# EasyEDA Pro project ProPrj_TD4-CPU_.epro, schematic TD4-CPU v1.1

## Sheets
1 ROM: Board Name: TD4_CPU v1.0; Create Date: 2024-11-04; Page Name: ROM; Project Name: CPU; Schematic Name: TD4-CPU v1.0; Update Date: 2024-11-12; Company: 嘉立创EDA; Drawed: WBH; Page Size: A3; Part Number: 20241104; Reviewed: WBH; Version: V1.0
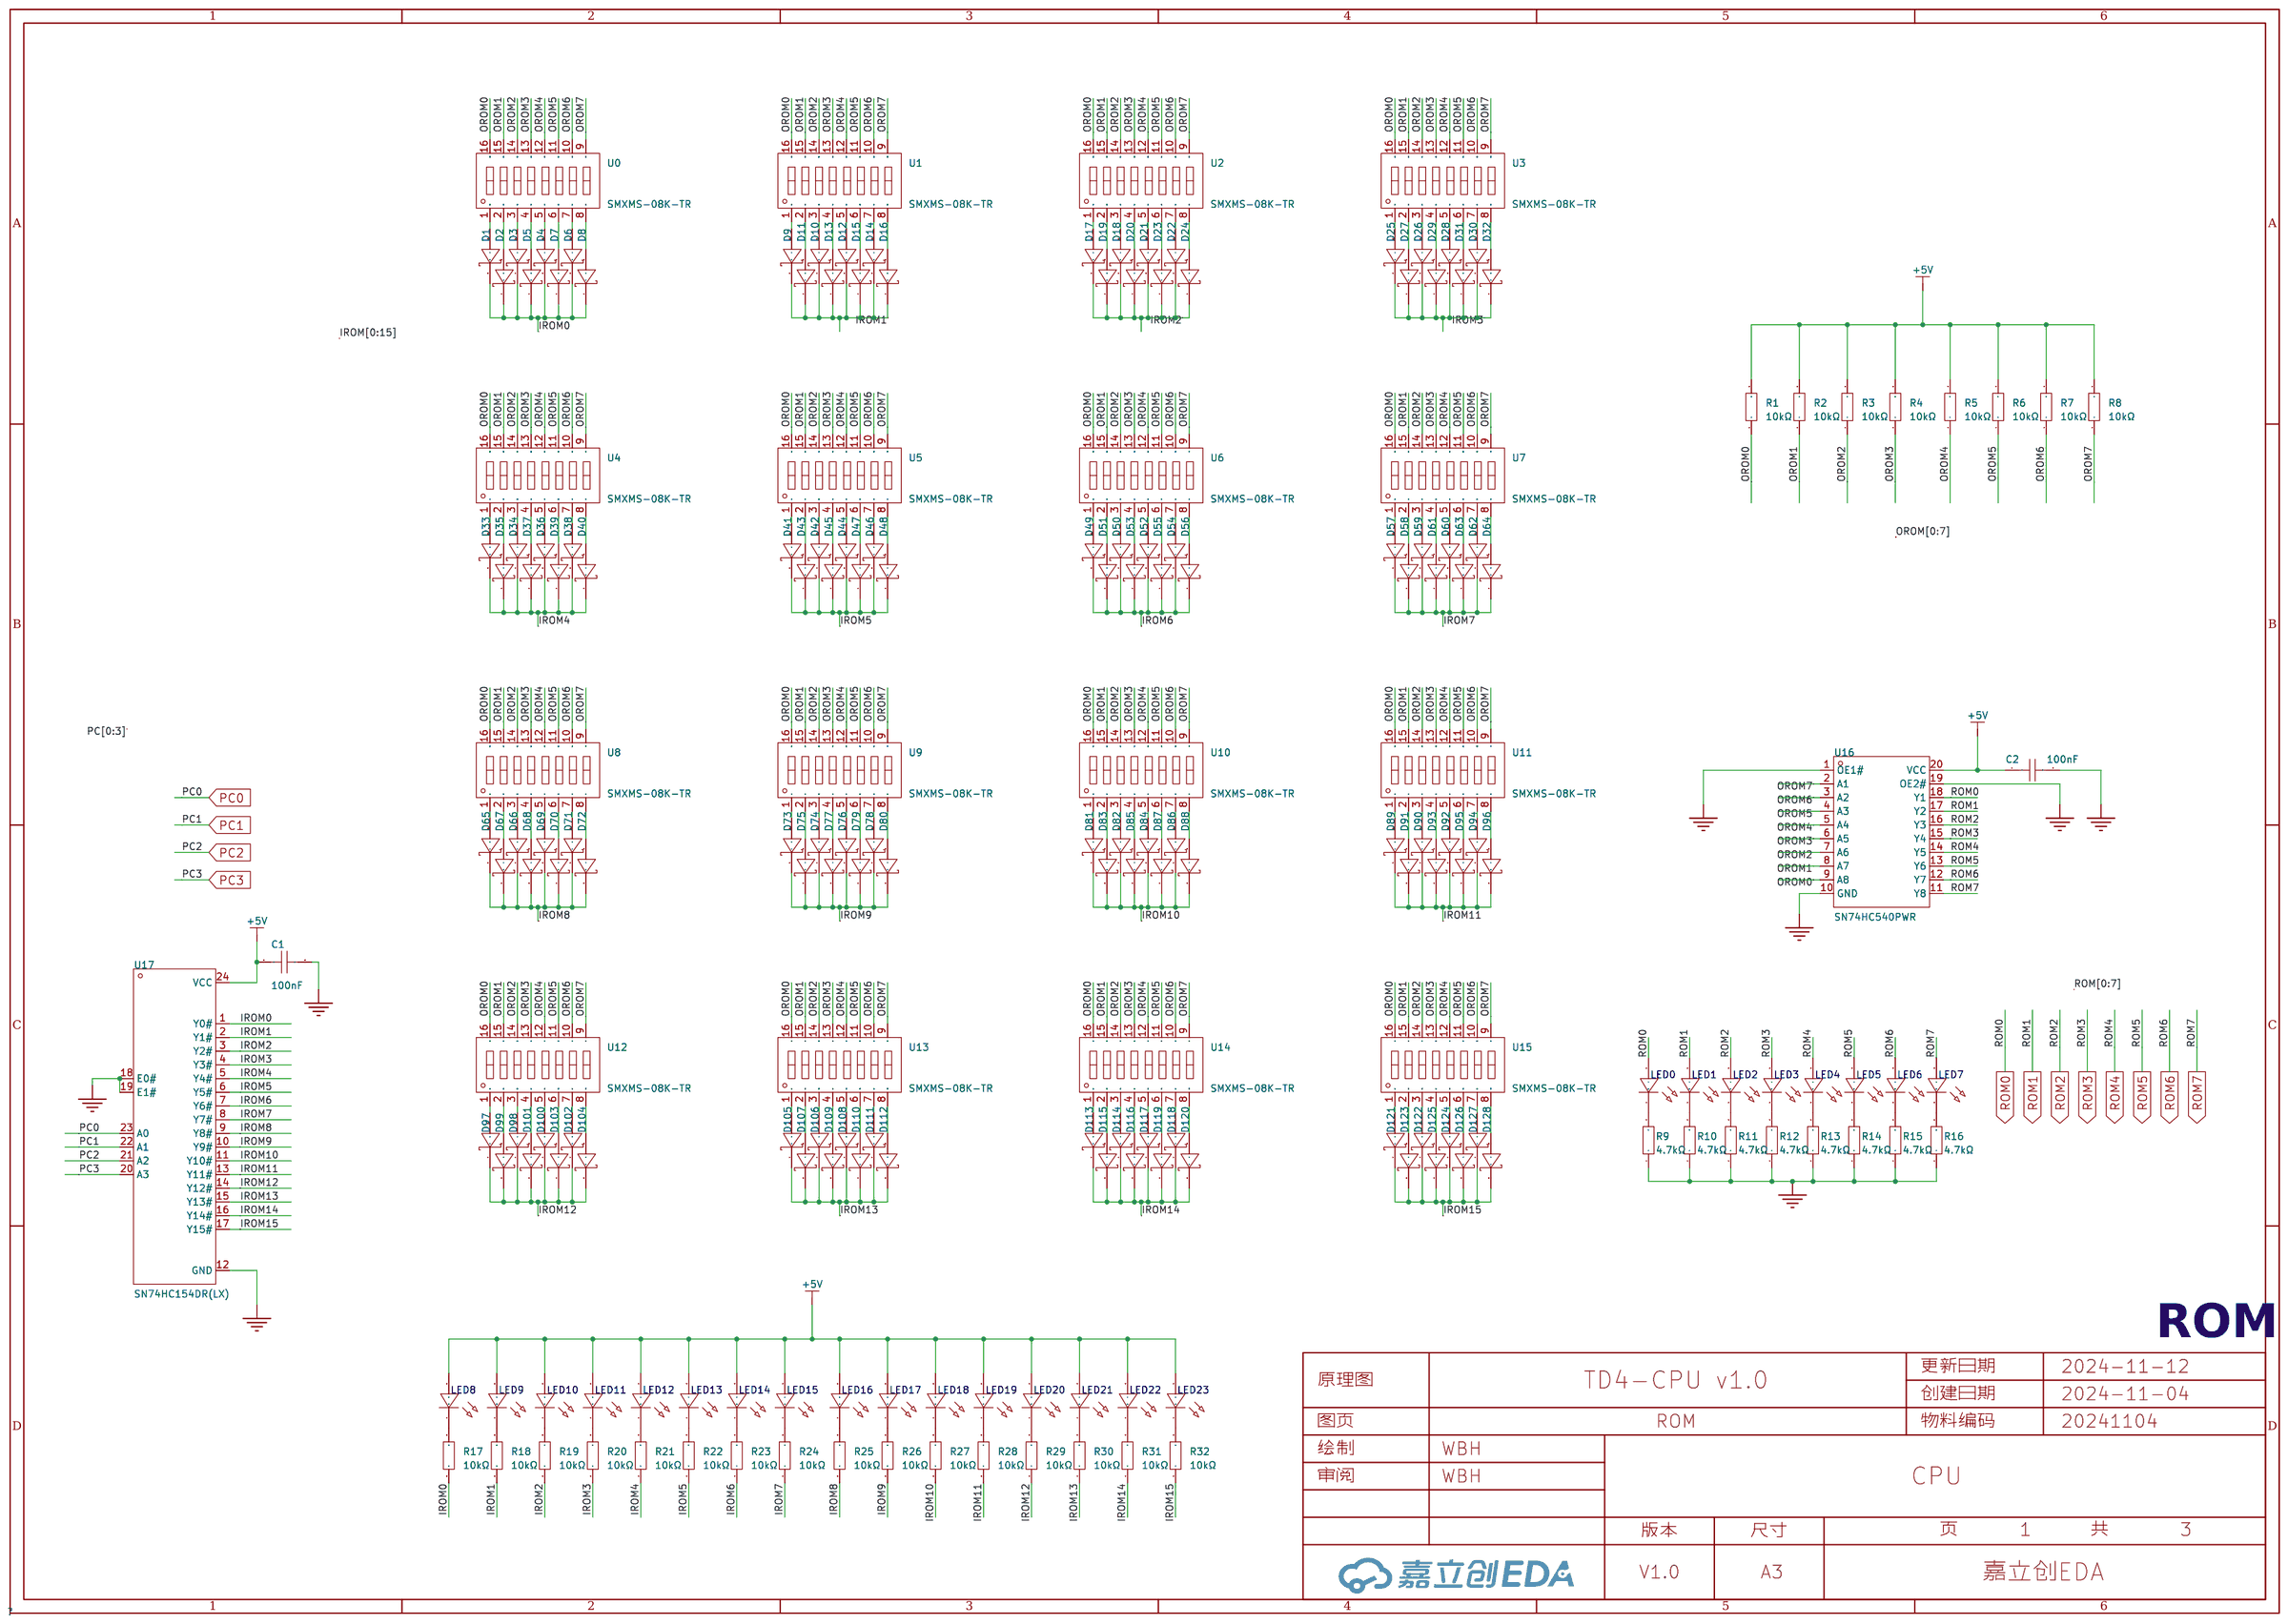
[diagram p0: ROM]
2 CPU: Board Name: TD4_CPU v1.1; Create Date: 2025-04-04; Page Name: CPU; Project Name: TD4-CPU; Schematic Name: TD4-CPU v1.1; Update Date: 2025-04-04
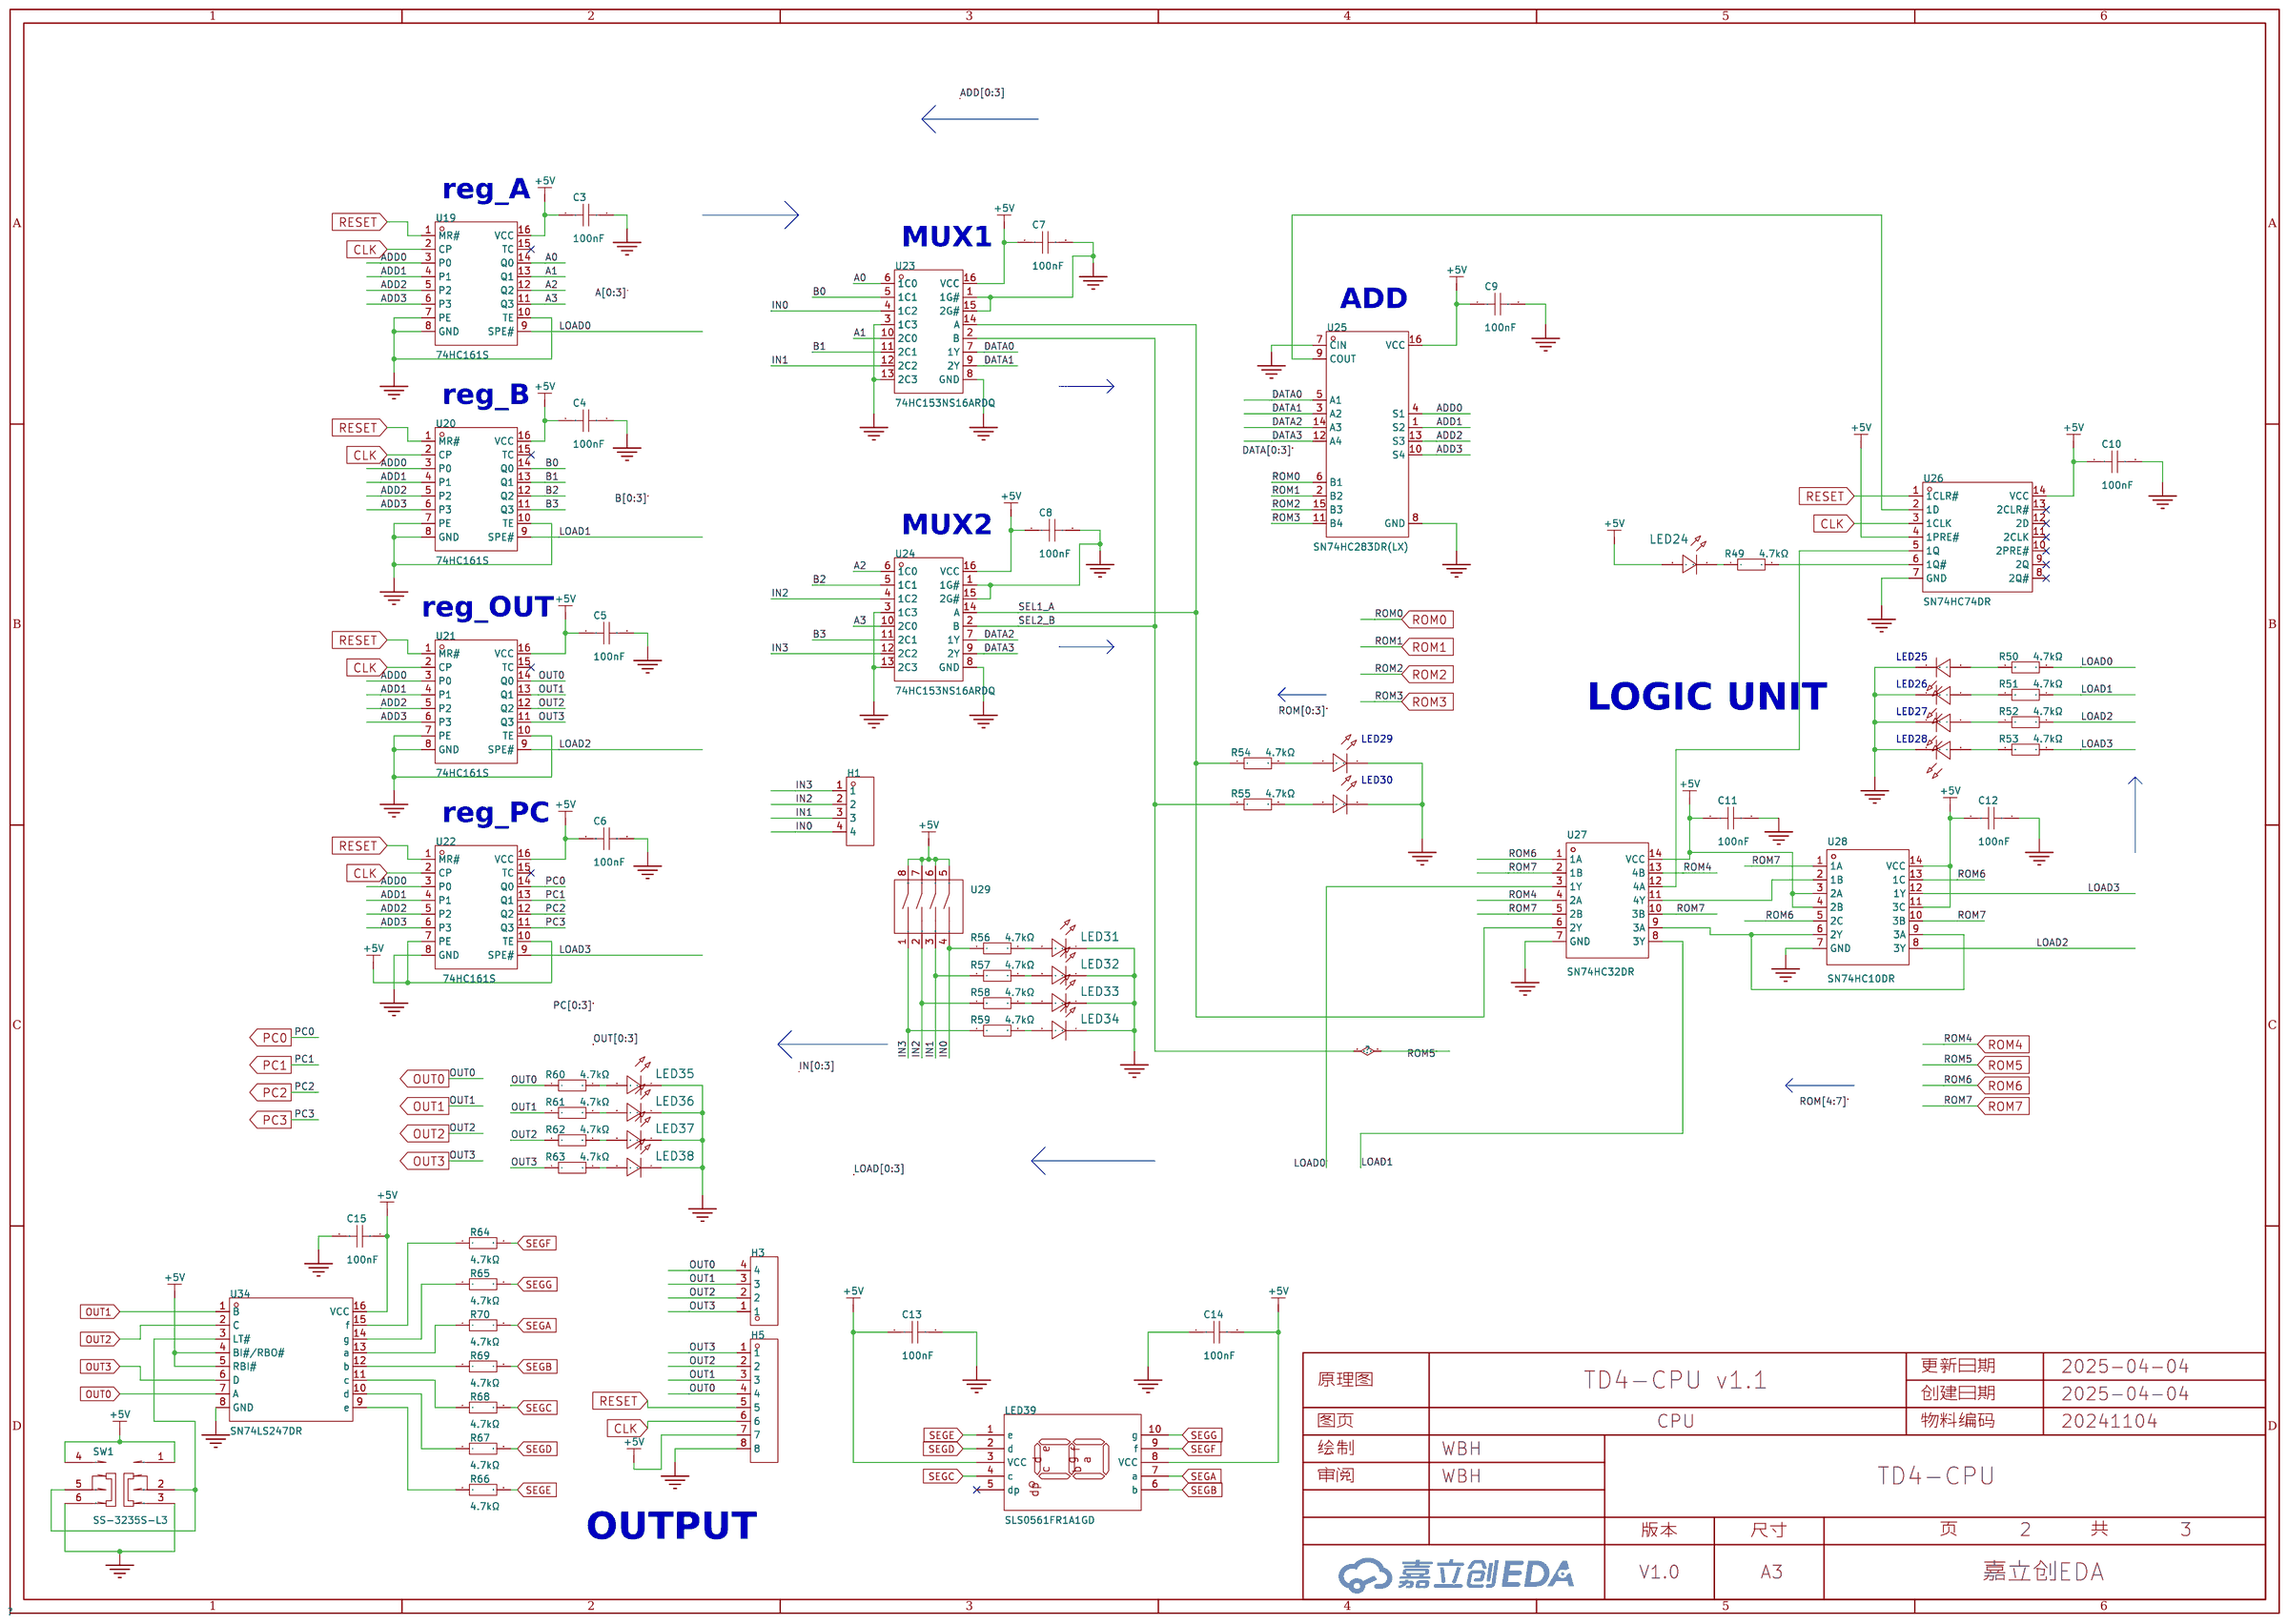
[diagram p1: CPU]
3 POWER&CLOCK&RESET: Board Name: TD4_CPU v1.1; Create Date: 2025-01-03; Page Name: POWER&CLOCK&RESET; Schematic Name: TD4-CPU v1.1; Update Date: 2025-01-20; Page Size: B
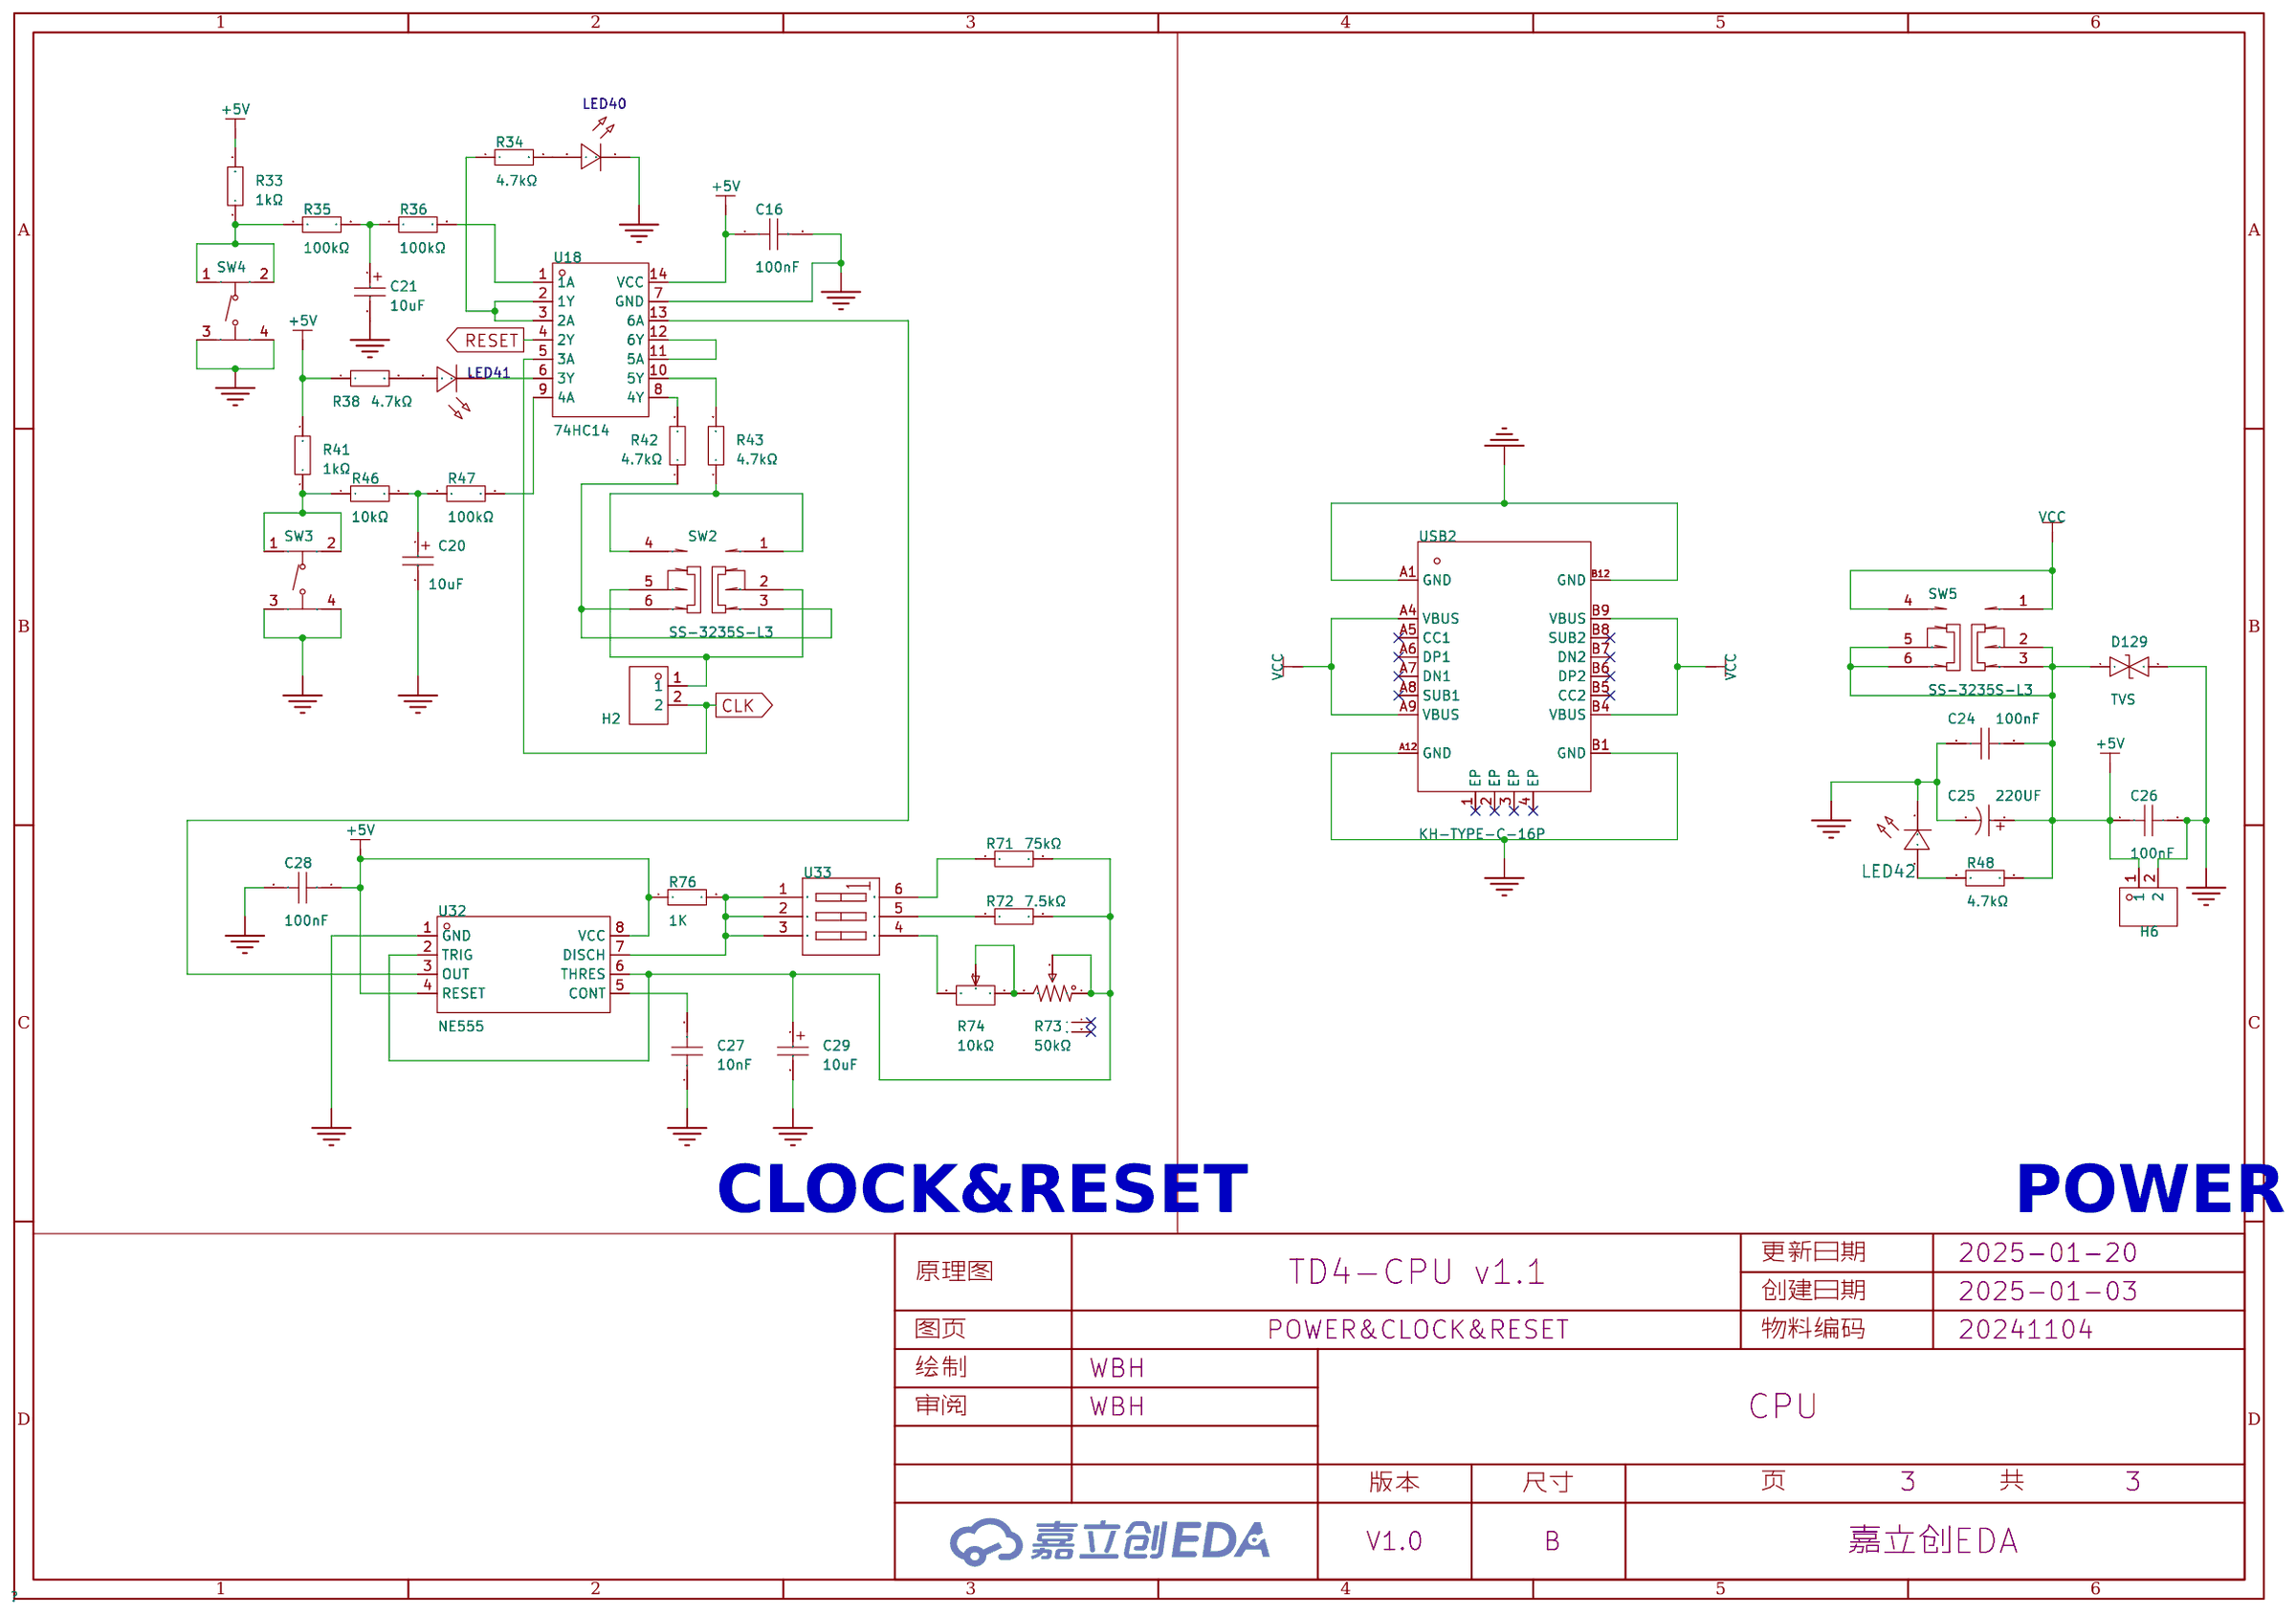
[diagram p2: POWER&CLOCK&RESET]

## Parts
sheet CPU
C3  100nF  [C0603]
C4  100nF  [C0603]
C5  100nF  [C0603]
C6  100nF  [C0603]
C7  100nF  [C0603]
C8  100nF  [C0603]
C9  100nF  [C0603]
C10  100nF  [C0603]
C11  100nF  [C0603]
C12  100nF  [C0603]
C13  100nF  [C0603]
C14  100nF  [C0603]
C15  100nF  [C0603]
H1  PZ254V-11-04P  [HDR-TH_4P-P2.54-V-M]
H3  PZ254V-11-04P  [HDR-TH_4P-P2.54-V-M]
H5  PZ254V-11-08P  [HDR-TH_8P-P2.54-V-M]
LED24  YLED0603R  [LED_0603]
LED25  YLED0603B  [LED_0603]
LED26  YLED0603B  [LED_0603]
LED27  YLED0603B  [LED_0603]
LED28  YLED0603B  [LED_0603]
LED29  YLED0603B  [LED_0603]
LED30  YLED0603B  [LED_0603]
LED31  YLED0603R  [LED_0603]
LED32  YLED0603R  [LED_0603]
LED33  YLED0603R  [LED_0603]
LED34  YLED0603R  [LED_0603]
LED35  YLED0603R  [LED_0603]
LED36  YLED0603R  [LED_0603]
LED37  YLED0603R  [LED_0603]
LED38  YLED0603R  [LED_0603]
LED39  SLS0561FR1A1GD  [LED-SEG-SMD_SLS0561FR1A1GD]
R49  4.7kΩ  [R0603]
R50  4.7kΩ  [R0603]
R51  4.7kΩ  [R0603]
R52  4.7kΩ  [R0603]
R53  4.7kΩ  [R0603]
R54  4.7kΩ  [R0603]
R55  4.7kΩ  [R0603]
R56  4.7kΩ  [R0603]
R57  4.7kΩ  [R0603]
R58  4.7kΩ  [R0603]
R59  4.7kΩ  [R0603]
R60  4.7kΩ  [R0603]
R61  4.7kΩ  [R0603]
R62  4.7kΩ  [R0603]
R63  4.7kΩ  [R0603]
R64  4.7kΩ  [R0603]
R65  4.7kΩ  [R0603]
R66  4.7kΩ  [R0603]
R67  4.7kΩ  [R0603]
R68  4.7kΩ  [R0603]
R69  4.7kΩ  [R0603]
R70  4.7kΩ  [R0603]
SW1  SS-3235S-L3  [SW-SMD_SS-3235S-L3.00]
U19  74HC161S  [SOIC-16_L9.9-W3.9-P1.27-LS6.0-BL-1]
U20  74HC161S  [SOIC-16_L9.9-W3.9-P1.27-LS6.0-BL-1]
U21  74HC161S  [SOIC-16_L9.9-W3.9-P1.27-LS6.0-BL-1]
U22  74HC161S  [SOIC-16_L9.9-W3.9-P1.27-LS6.0-BL-1]
U23  74HC153NS16ARDQ  [SOP-16_L10.0-W3.9-P1.27-LS6.0-BL]
U24  74HC153NS16ARDQ  [SOP-16_L10.0-W3.9-P1.27-LS6.0-BL]
U25  SN74HC283DR(LX)  [SOP-16_L9.9-W3.9-P1.27-LS6.0-BL]
U26  SN74HC74DR  [SOIC-14_L8.7-W3.9-P1.27-LS6.0-BL]
U27  SN74HC32DR  [SOIC-14_L8.7-W3.9-P1.27-LS6.0-BL]
U28  SN74HC10DR  [SOIC-14_L8.7-W3.9-P1.27-LS6.0-BL]
U29  DSHP04TSGER  [SW-SMD_8P-L6.7-W5.4-P1.27-LS8.4]
U34  SN74LS247DR  [SOP-16_L9.9-W3.9-P1.27-LS6.0-BL]
sheet POWER&CLOCK&RESET
C16  100nF  [C0603]
C20  10uF  [CAP-SMD_L3.2-W1.6-RD]
C21  10uF  [CAP-SMD_L3.2-W1.6-RD]
C24  100nF  [C0805]
C25  220UF  [CAP-SMD_BD6.3-L6.6-W6.6-LS7.2-FD]
C26  100nF  [C0603]
C27  10nF  [C0603]
C28  100nF  [C0603]
C29  10uF  [CAP-SMD_L3.2-W1.6-RD]
D129  TVS  [SOD-523_L1.2-W0.8-LS1.6-BI]
H2  PZ254V-11-02P  [HDR-TH_2P-P2.54-V-M]
H6  PZ254V-11-02P  [HDR-TH_2P-P2.54-V-M]
LED40  YLED0603B  [LED_0603]
LED41  YLED0603B  [LED_0603]
LED42  YLED0603R  [LED_0603]
R33  1kΩ  [R0603]
R34  4.7kΩ  [R0603]
R35  100kΩ  [R0603]
R36  100kΩ  [R0603]
R38  4.7kΩ  [R0603]
R41  1kΩ  [R0603]
R42  4.7kΩ  [R0603]
R43  4.7kΩ  [R0603]
R46  10kΩ  [R0603]
R47  100kΩ  [R0603]
R48  4.7kΩ  [R0603]
R71  75kΩ  [R0603]
R72  7.5kΩ  [R0603]
R73  50kΩ  [RES-TH_RK09K1130AAU]
R74  10kΩ  [RES-ADJ-TH_3296W]
R76  1K  [R0603]
SW2  SS-3235S-L3  [SW-SMD_SS-3235S-L3.00]
SW3  TS-1187A-B-A-B  [SW-SMD_4P-L5.1-W5.1-P3.70-LS6.5-TL-2]
SW4  TS-1187A-B-A-B  [SW-SMD_4P-L5.1-W5.1-P3.70-LS6.5-TL-2]
SW5  SS-3235S-L3  [SW-SMD_SS-3235S-L3.00]
U18  74HC14  [SOIC-14_L8.7-W3.9-P1.27-LS6.0-BL]
U32  NE555  [SOP-8_L5.0-W4.0-P1.27-LS6.0-BL]
U33  DSHP03TSGER  [SW-SMD_6P-L5.4-W5.4-P1.27-LS8.4]
USB2  KH-TYPE-C-16P  [USB-C-SMD_KH-TYPE-C-16P]
sheet ROM
C1  100nF  [C0603]
C2  100nF  [C0603]
D1  1N5819WS  [SOD-323_L1.8-W1.3-LS2.5-RD]
D2  1N5819WS  [SOD-323_L1.8-W1.3-LS2.5-RD]
D3  1N5819WS  [SOD-323_L1.8-W1.3-LS2.5-RD]
D4  1N5819WS  [SOD-323_L1.8-W1.3-LS2.5-RD]
D5  1N5819WS  [SOD-323_L1.8-W1.3-LS2.5-RD]
D6  1N5819WS  [SOD-323_L1.8-W1.3-LS2.5-RD]
D7  1N5819WS  [SOD-323_L1.8-W1.3-LS2.5-RD]
D8  1N5819WS  [SOD-323_L1.8-W1.3-LS2.5-RD]
D9  1N5819WS  [SOD-323_L1.8-W1.3-LS2.5-RD]
D10  1N5819WS  [SOD-323_L1.8-W1.3-LS2.5-RD]
D11  1N5819WS  [SOD-323_L1.8-W1.3-LS2.5-RD]
D12  1N5819WS  [SOD-323_L1.8-W1.3-LS2.5-RD]
D13  1N5819WS  [SOD-323_L1.8-W1.3-LS2.5-RD]
D14  1N5819WS  [SOD-323_L1.8-W1.3-LS2.5-RD]
D15  1N5819WS  [SOD-323_L1.8-W1.3-LS2.5-RD]
D16  1N5819WS  [SOD-323_L1.8-W1.3-LS2.5-RD]
D17  1N5819WS  [SOD-323_L1.8-W1.3-LS2.5-RD]
D18  1N5819WS  [SOD-323_L1.8-W1.3-LS2.5-RD]
D19  1N5819WS  [SOD-323_L1.8-W1.3-LS2.5-RD]
D20  1N5819WS  [SOD-323_L1.8-W1.3-LS2.5-RD]
D21  1N5819WS  [SOD-323_L1.8-W1.3-LS2.5-RD]
D22  1N5819WS  [SOD-323_L1.8-W1.3-LS2.5-RD]
D23  1N5819WS  [SOD-323_L1.8-W1.3-LS2.5-RD]
D24  1N5819WS  [SOD-323_L1.8-W1.3-LS2.5-RD]
D25  1N5819WS  [SOD-323_L1.8-W1.3-LS2.5-RD]
D26  1N5819WS  [SOD-323_L1.8-W1.3-LS2.5-RD]
D27  1N5819WS  [SOD-323_L1.8-W1.3-LS2.5-RD]
D28  1N5819WS  [SOD-323_L1.8-W1.3-LS2.5-RD]
D29  1N5819WS  [SOD-323_L1.8-W1.3-LS2.5-RD]
D30  1N5819WS  [SOD-323_L1.8-W1.3-LS2.5-RD]
D31  1N5819WS  [SOD-323_L1.8-W1.3-LS2.5-RD]
D32  1N5819WS  [SOD-323_L1.8-W1.3-LS2.5-RD]
D33  1N5819WS  [SOD-323_L1.8-W1.3-LS2.5-RD]
D34  1N5819WS  [SOD-323_L1.8-W1.3-LS2.5-RD]
D35  1N5819WS  [SOD-323_L1.8-W1.3-LS2.5-RD]
D36  1N5819WS  [SOD-323_L1.8-W1.3-LS2.5-RD]
D37  1N5819WS  [SOD-323_L1.8-W1.3-LS2.5-RD]
D38  1N5819WS  [SOD-323_L1.8-W1.3-LS2.5-RD]
D39  1N5819WS  [SOD-323_L1.8-W1.3-LS2.5-RD]
D40  1N5819WS  [SOD-323_L1.8-W1.3-LS2.5-RD]
D41  1N5819WS  [SOD-323_L1.8-W1.3-LS2.5-RD]
D42  1N5819WS  [SOD-323_L1.8-W1.3-LS2.5-RD]
D43  1N5819WS  [SOD-323_L1.8-W1.3-LS2.5-RD]
D44  1N5819WS  [SOD-323_L1.8-W1.3-LS2.5-RD]
D45  1N5819WS  [SOD-323_L1.8-W1.3-LS2.5-RD]
D46  1N5819WS  [SOD-323_L1.8-W1.3-LS2.5-RD]
D47  1N5819WS  [SOD-323_L1.8-W1.3-LS2.5-RD]
D48  1N5819WS  [SOD-323_L1.8-W1.3-LS2.5-RD]
D49  1N5819WS  [SOD-323_L1.8-W1.3-LS2.5-RD]
D50  1N5819WS  [SOD-323_L1.8-W1.3-LS2.5-RD]
D51  1N5819WS  [SOD-323_L1.8-W1.3-LS2.5-RD]
D52  1N5819WS  [SOD-323_L1.8-W1.3-LS2.5-RD]
D53  1N5819WS  [SOD-323_L1.8-W1.3-LS2.5-RD]
D54  1N5819WS  [SOD-323_L1.8-W1.3-LS2.5-RD]
D55  1N5819WS  [SOD-323_L1.8-W1.3-LS2.5-RD]
D56  1N5819WS  [SOD-323_L1.8-W1.3-LS2.5-RD]
D57  1N5819WS  [SOD-323_L1.8-W1.3-LS2.5-RD]
D58  1N5819WS  [SOD-323_L1.8-W1.3-LS2.5-RD]
D59  1N5819WS  [SOD-323_L1.8-W1.3-LS2.5-RD]
D60  1N5819WS  [SOD-323_L1.8-W1.3-LS2.5-RD]
D61  1N5819WS  [SOD-323_L1.8-W1.3-LS2.5-RD]
D62  1N5819WS  [SOD-323_L1.8-W1.3-LS2.5-RD]
D63  1N5819WS  [SOD-323_L1.8-W1.3-LS2.5-RD]
D64  1N5819WS  [SOD-323_L1.8-W1.3-LS2.5-RD]
D65  1N5819WS  [SOD-323_L1.8-W1.3-LS2.5-RD]
D66  1N5819WS  [SOD-323_L1.8-W1.3-LS2.5-RD]
D67  1N5819WS  [SOD-323_L1.8-W1.3-LS2.5-RD]
D68  1N5819WS  [SOD-323_L1.8-W1.3-LS2.5-RD]
D69  1N5819WS  [SOD-323_L1.8-W1.3-LS2.5-RD]
D70  1N5819WS  [SOD-323_L1.8-W1.3-LS2.5-RD]
D71  1N5819WS  [SOD-323_L1.8-W1.3-LS2.5-RD]
D72  1N5819WS  [SOD-323_L1.8-W1.3-LS2.5-RD]
D73  1N5819WS  [SOD-323_L1.8-W1.3-LS2.5-RD]
D74  1N5819WS  [SOD-323_L1.8-W1.3-LS2.5-RD]
D75  1N5819WS  [SOD-323_L1.8-W1.3-LS2.5-RD]
D76  1N5819WS  [SOD-323_L1.8-W1.3-LS2.5-RD]
D77  1N5819WS  [SOD-323_L1.8-W1.3-LS2.5-RD]
D78  1N5819WS  [SOD-323_L1.8-W1.3-LS2.5-RD]
D79  1N5819WS  [SOD-323_L1.8-W1.3-LS2.5-RD]
D80  1N5819WS  [SOD-323_L1.8-W1.3-LS2.5-RD]
D81  1N5819WS  [SOD-323_L1.8-W1.3-LS2.5-RD]
D82  1N5819WS  [SOD-323_L1.8-W1.3-LS2.5-RD]
D83  1N5819WS  [SOD-323_L1.8-W1.3-LS2.5-RD]
D84  1N5819WS  [SOD-323_L1.8-W1.3-LS2.5-RD]
D85  1N5819WS  [SOD-323_L1.8-W1.3-LS2.5-RD]
D86  1N5819WS  [SOD-323_L1.8-W1.3-LS2.5-RD]
D87  1N5819WS  [SOD-323_L1.8-W1.3-LS2.5-RD]
D88  1N5819WS  [SOD-323_L1.8-W1.3-LS2.5-RD]
D89  1N5819WS  [SOD-323_L1.8-W1.3-LS2.5-RD]
D90  1N5819WS  [SOD-323_L1.8-W1.3-LS2.5-RD]
D91  1N5819WS  [SOD-323_L1.8-W1.3-LS2.5-RD]
D92  1N5819WS  [SOD-323_L1.8-W1.3-LS2.5-RD]
D93  1N5819WS  [SOD-323_L1.8-W1.3-LS2.5-RD]
D94  1N5819WS  [SOD-323_L1.8-W1.3-LS2.5-RD]
D95  1N5819WS  [SOD-323_L1.8-W1.3-LS2.5-RD]
D96  1N5819WS  [SOD-323_L1.8-W1.3-LS2.5-RD]
D97  1N5819WS  [SOD-323_L1.8-W1.3-LS2.5-RD]
D98  1N5819WS  [SOD-323_L1.8-W1.3-LS2.5-RD]
D99  1N5819WS  [SOD-323_L1.8-W1.3-LS2.5-RD]
D100  1N5819WS  [SOD-323_L1.8-W1.3-LS2.5-RD]
D101  1N5819WS  [SOD-323_L1.8-W1.3-LS2.5-RD]
D102  1N5819WS  [SOD-323_L1.8-W1.3-LS2.5-RD]
D103  1N5819WS  [SOD-323_L1.8-W1.3-LS2.5-RD]
D104  1N5819WS  [SOD-323_L1.8-W1.3-LS2.5-RD]
D105  1N5819WS  [SOD-323_L1.8-W1.3-LS2.5-RD]
D106  1N5819WS  [SOD-323_L1.8-W1.3-LS2.5-RD]
D107  1N5819WS  [SOD-323_L1.8-W1.3-LS2.5-RD]
D108  1N5819WS  [SOD-323_L1.8-W1.3-LS2.5-RD]
D109  1N5819WS  [SOD-323_L1.8-W1.3-LS2.5-RD]
D110  1N5819WS  [SOD-323_L1.8-W1.3-LS2.5-RD]
D111  1N5819WS  [SOD-323_L1.8-W1.3-LS2.5-RD]
D112  1N5819WS  [SOD-323_L1.8-W1.3-LS2.5-RD]
D113  1N5819WS  [SOD-323_L1.8-W1.3-LS2.5-RD]
D114  1N5819WS  [SOD-323_L1.8-W1.3-LS2.5-RD]
D115  1N5819WS  [SOD-323_L1.8-W1.3-LS2.5-RD]
D116  1N5819WS  [SOD-323_L1.8-W1.3-LS2.5-RD]
D117  1N5819WS  [SOD-323_L1.8-W1.3-LS2.5-RD]
D118  1N5819WS  [SOD-323_L1.8-W1.3-LS2.5-RD]
D119  1N5819WS  [SOD-323_L1.8-W1.3-LS2.5-RD]
D120  1N5819WS  [SOD-323_L1.8-W1.3-LS2.5-RD]
D121  1N5819WS  [SOD-323_L1.8-W1.3-LS2.5-RD]
D122  1N5819WS  [SOD-323_L1.8-W1.3-LS2.5-RD]
D123  1N5819WS  [SOD-323_L1.8-W1.3-LS2.5-RD]
D124  1N5819WS  [SOD-323_L1.8-W1.3-LS2.5-RD]
D125  1N5819WS  [SOD-323_L1.8-W1.3-LS2.5-RD]
D126  1N5819WS  [SOD-323_L1.8-W1.3-LS2.5-RD]
D127  1N5819WS  [SOD-323_L1.8-W1.3-LS2.5-RD]
D128  1N5819WS  [SOD-323_L1.8-W1.3-LS2.5-RD]
LED0  YLED0603G  [LED_0603]
LED1  YLED0603G  [LED_0603]
LED2  YLED0603G  [LED_0603]
LED3  YLED0603G  [LED_0603]
LED4  YLED0603G  [LED_0603]
LED5  YLED0603G  [LED_0603]
LED6  YLED0603G  [LED_0603]
LED7  YLED0603G  [LED_0603]
LED8  YLED0603G  [LED_0603]
LED9  YLED0603G  [LED_0603]
LED10  YLED0603G  [LED_0603]
LED11  YLED0603G  [LED_0603]
LED12  YLED0603G  [LED_0603]
LED13  YLED0603G  [LED_0603]
LED14  YLED0603G  [LED_0603]
LED15  YLED0603G  [LED_0603]
LED16  YLED0603G  [LED_0603]
LED17  YLED0603G  [LED_0603]
LED18  YLED0603G  [LED_0603]
LED19  YLED0603G  [LED_0603]
LED20  YLED0603G  [LED_0603]
LED21  YLED0603G  [LED_0603]
LED22  YLED0603G  [LED_0603]
LED23  YLED0603G  [LED_0603]
R1  10kΩ  [R0603]
R2  10kΩ  [R0603]
R3  10kΩ  [R0603]
R4  10kΩ  [R0603]
R5  10kΩ  [R0603]
R6  10kΩ  [R0603]
R7  10kΩ  [R0603]
R8  10kΩ  [R0603]
R9  4.7kΩ  [R0603]
R10  4.7kΩ  [R0603]
R11  4.7kΩ  [R0603]
R12  4.7kΩ  [R0603]
R13  4.7kΩ  [R0603]
R14  4.7kΩ  [R0603]
R15  4.7kΩ  [R0603]
R16  4.7kΩ  [R0603]
R17  10kΩ  [R0603]
R18  10kΩ  [R0603]
R19  10kΩ  [R0603]
R20  10kΩ  [R0603]
R21  10kΩ  [R0603]
R22  10kΩ  [R0603]
R23  10kΩ  [R0603]
R24  10kΩ  [R0603]
R25  10kΩ  [R0603]
R26  10kΩ  [R0603]
R27  10kΩ  [R0603]
R28  10kΩ  [R0603]
R29  10kΩ  [R0603]
R30  10kΩ  [R0603]
R31  10kΩ  [R0603]
R32  10kΩ  [R0603]
U0  SMXMS-08K-TR  [SW-SMD_16P-L11.7-W5.4-P1.27-LS8.5_1]
U1  SMXMS-08K-TR  [SW-SMD_16P-L11.7-W5.4-P1.27-LS8.5_1]
U2  SMXMS-08K-TR  [SW-SMD_16P-L11.7-W5.4-P1.27-LS8.5_1]
U3  SMXMS-08K-TR  [SW-SMD_16P-L11.7-W5.4-P1.27-LS8.5_1]
U4  SMXMS-08K-TR  [SW-SMD_16P-L11.7-W5.4-P1.27-LS8.5_1]
U5  SMXMS-08K-TR  [SW-SMD_16P-L11.7-W5.4-P1.27-LS8.5_1]
U6  SMXMS-08K-TR  [SW-SMD_16P-L11.7-W5.4-P1.27-LS8.5_1]
U7  SMXMS-08K-TR  [SW-SMD_16P-L11.7-W5.4-P1.27-LS8.5_1]
U8  SMXMS-08K-TR  [SW-SMD_16P-L11.7-W5.4-P1.27-LS8.5_1]
U9  SMXMS-08K-TR  [SW-SMD_16P-L11.7-W5.4-P1.27-LS8.5_1]
U10  SMXMS-08K-TR  [SW-SMD_16P-L11.7-W5.4-P1.27-LS8.5_1]
U11  SMXMS-08K-TR  [SW-SMD_16P-L11.7-W5.4-P1.27-LS8.5_1]
U12  SMXMS-08K-TR  [SW-SMD_16P-L11.7-W5.4-P1.27-LS8.5_1]
U13  SMXMS-08K-TR  [SW-SMD_16P-L11.7-W5.4-P1.27-LS8.5_1]
U14  SMXMS-08K-TR  [SW-SMD_16P-L11.7-W5.4-P1.27-LS8.5_1]
U15  SMXMS-08K-TR  [SW-SMD_16P-L11.7-W5.4-P1.27-LS8.5_1]
U16  SN74HC540PWR  [TSSOP-20_L6.5-W4.4-P0.65-LS6.4-BL]
U17  SN74HC154DR(LX)  [SOP-24_L15.2-W7.5-P1.27-LS10.3-BL]

## Library data of the parts
C1-C16 C26 C28 = CGA0603X7R104K500JT: 容值:100nF;精度:±10%;额定电压:50V;材质(温度系数):X7R;; LCSC Part Name: 100nF ±10% 50V; Supplier Part: C6119867; Manufacturer: HRE(芯声); Supplier Footprint: 0603; JLCPCB Part Class: Extended Part; Supplier: LCSC; Tolerance: ±10%; Voltage Rated: 50V; Temperature Coefficient: X7R
H1 H3 = PZ254V-11-04P: 插针结构:1x4P;间距:2.54mm;行距:-;圆针/方针:方针;安装类型:直插;排数:单排;总PIN位数:4P;额定电流:3A;额定电压:250V;配合针长度:6mm;塑高:2.5mm;端接针长度:3mm;触头材质:-;工作温度范围:-40℃~+105℃;颜色:黑色;; LCSC Part Name: 间距:2.54mm 1x4P 直插 方针; Supplier Part: C2691448; Manufacturer: XFCN(兴飞); Supplier Footprint: 插件,P=2.54mm; JLCPCB Part Class: 扩展库; Datasheet: https://atta.szlcsc.com/upload/public/pdf/source/20200309/C492403_F9F19131791D08044AD4F84F8E751A34.pdf; Supplier: LCSC; Pin Structure: 1x4P; Pitch: 2.54mm; Circluar Pins/Square Pins: 方针; Mounting Type: 直插; Number of Rows: 单排; Number of Pins: 4P; Current Rating (Max): 3A; Voltage Rating (Max): 250V; Length of Mating Pin: 6mm; Insulation Height: 2.5mm; Length of End Connection Pin: 3mm; Operating Temperature Range: -40℃~+105℃; Color: 黑色
H5 = PZ254V-11-08P: 插针结构:1x8P;间距:2.54mm;行距:-;圆针/方针:方针;安装类型:直插;排数:单排;总PIN位数:8P;额定电流:-;额定电压:-;配合针长度:6mm;塑高:2.5mm;端接针长度:3mm;触头材质:黄铜;触头镀层:-;工作温度范围:-40℃~+105℃;颜色:黑色;; LCSC Part Name: 间距:2.54mm 1x8P 直插 方针; Supplier Part: C492407; Manufacturer: XFCN(兴飞); Supplier Footprint: 插件,P=2.54mm; JLCPCB Part Class: 扩展库; Datasheet: https://atta.szlcsc.com/upload/public/pdf/source/20200309/C492407_83A6FB26A2233368EDB9516968EC6149.pdf; Supplier: LCSC; Pin Structure: 1x8P; Pitch: 2.54mm; Circluar Pins/Square Pins: 方针; Mounting Type: 直插; Number of Rows: 单排; Number of Pins: 8P; Length of Mating Pin: 6mm; Insulation Height: 2.5mm; Length of End Connection Pin: 3mm; Contact Material: 黄铜; Operating Temperature Range: -40℃~+105℃; Color: 黑色
LED24 LED31-LED38 LED42 = YLED0603R: 发光颜色:红色;正向电压(VF):1.8V~2.4V;功率:-;正向电流:25mA;主波长:620nm~625nm;二极管配置:-;透镜颜色:-;色温:-;发光强度:-;发光角度:-;载带方式:-;工作温度:-40℃~+85℃;; Supplier Part: C19171390; Manufacturer: YONGYUTAI(永裕泰); Supplier Footprint: 0603; JLCPCB Part Class: Extended Part; Datasheet: https://atta.szlcsc.com/upload/public/pdf/source/20231027/FB19AF06E2C70028E58AB5CEDD1BDC72.pdf; Supplier: LCSC; Emitted Color: 红色; Forward Voltage (VF): 1.8V~2.4V; Forward Current: 25mA; Dominant Wavelength: 620nm~625nm; Operating Temperature: -40℃~+85℃
LED25-LED30 LED40 LED41 = YLED0603B: 发光颜色:蓝色;正向电压(VF):2.6V~3.2V;功率:-;正向电流:30mA;主波长:460nm~475nm;发光角度:120°;工作温度:-40℃~+85℃;; Supplier Part: C19171394; Manufacturer: YONGYUTAI(永裕泰); Supplier Footprint: 0603; JLCPCB Part Class: Extended Part; Datasheet: https://atta.szlcsc.com/upload/public/pdf/source/20231027/6134FF4BA718E32A802654BBC76F69A6.pdf; Supplier: LCSC; Emitted Color: 蓝色; Forward Voltage (VF): 2.6V~3.2V; Forward Current: 30mA; Dominant Wavelength: 460nm~475nm; Viewing Angle: 120°; Operating Temperature: -40℃~+85℃
LED39 = SLS0561FR1A1GD: 发光颜色:-;; LCSC Part Name: 0.56英寸,一位,红光,贴片LED数码管; Supplier Part: C694253; Manufacturer: SUNLIGHT(光华); Supplier Footprint: SMD; JLCPCB Part Class: 扩展库; Datasheet: https://atta.szlcsc.com/upload/public/pdf/source/20200903/C694253_F19DD38BA5874F0EA574294E68826BA1.pdf; Supplier: LCSC
R9-R16 R34 R38 R42 R48-R70 = 0603WAF4701T5E: 电阻类型:厚膜电阻;阻值:4.7kΩ;精度:±1%;功率:100mW;最大工作电压:75V;温度系数:±100ppm/℃;; LCSC Part Name: 4.7kΩ ±1% 100mW 厚膜电阻; Supplier Part: C23162; Manufacturer: UNI-ROYAL(厚声); Supplier Footprint: 0603; JLCPCB Part Class: Basic Part; Datasheet: https://atta.szlcsc.com/upload/public/pdf/source/20200306/C422600_1E6D84923E4A46A82E41ADD87F860B5C.pdf; Supplier: LCSC; Type: 厚膜电阻; Tolerance: ±1%; Power(Watts): 100mW; Overload Voltage (Max): 75V; Temperature Coefficient: ±100ppm/℃; Operating Temperature Range: -55℃~+155℃
SW1 SW2 SW5 = SS-3235S-L3: 电路结构:双刀双掷;安装方式:立贴;开关颜色:黑色;额定电流(DC):50mA;额定电压(DC):12V;额定电流(AC):50mA;额定电压(AC):12V;机械寿命:1万次;; LCSC Part Name: 柄长4mm 立贴双档 滑动开关; Supplier Part: C381098; Manufacturer: XKB Connectivity(中国星坤); Supplier Footprint: SMD; JLCPCB Part Class: 扩展库; Datasheet: https://atta.szlcsc.com/upload/public/pdf/source/20200227/C381098_2A18B7660478ED4C962829E19BCD5514.pdf; Supplier: LCSC; Circuit: 双刀双掷; Actuator Style: 矩形柱状; Pin Style: SMD接片; Switch Length: 9.1mm; Switch Width: 3.55mm; Switch Height: 6.6mm; Mounting Style: 立贴; Actuator Color: 黑色; Current Rating (DC): 50mA; Voltage Rating (DC): 12V; Current Rating (AC): 50mA; Voltage Rating (AC): 12V; Mechanical Life: 1万次; Operating Temperature: -40℃~+85℃
U19-U22 = 74HC161S: Supplier Part: C22357610; Manufacturer: GR(国睿); Supplier Footprint: SOP-16; JLCPCB Part Class: 扩展库; Datasheet: https://atta.szlcsc.com/upload/public/pdf/source/20240312/770DE99EF1915923887E9198A4811C81.pdf; Supplier: LCSC
U23 U24 = 74HC153NS16ARDQ: 双通道、4 线路到 1 线路数据选择器/多路复用器; LCSC Part Name: 74HC153; Supplier Part: C22465473; Manufacturer: GR(国睿); Supplier Footprint: SOP-16; JLCPCB Part Class: Extended Part; Datasheet: https://atta.szlcsc.com/upload/public/pdf/source/20240628/26249B4631BC5793A601203C96E1EDFB.pdf; Supplier: LCSC
U25 = SN74HC283DR(LX): 电源电压:2V~6V;; LCSC Part Name: 集成电路; Supplier Part: C24833609; Manufacturer: LX(灵星芯微); Supplier Footprint: SOP-16; JLCPCB Part Class: 扩展库; Datasheet: https://atta.szlcsc.com/upload/public/pdf/source/20240703/B0003D947FB19BE3D11F836D5686647F.pdf; Supplier: LCSC; Supply Voltage: 2V~6V; Operating Temperature: -40℃~+125℃
U26 = SN74HC74DR: 类型:D-型;电源电压:2V~6V;时钟频率:60MHz;元件数:2;每个元件位数:1;最大传播延迟:15ns@6V,50pF;静态电流(Iq):4uA;; Supplier Part: C6762; Manufacturer: TI(德州仪器); Supplier Footprint: SOIC-14; JLCPCB Part Class: 扩展库; Datasheet: https://www.ti.com/cn/lit/gpn/sn74hc74; Supplier: LCSC; Type: D-型; Trigger Type: 上升沿; Supply Voltage: 2V~6V; Clock Frequency: 60MHz; Function: 置位和复位; Number of Elements: 2; Number of Bits per Element: 1; Output Type: 互补型; Maximum Propagation Delay: 15ns@6V,50pF; Series: 74HC系列; Sink Current: 5.2mA; Source Current: 5.2mA; Quiescent Current (Iq): 4uA; Input Capacitance: 3pF; Operating Temperature: -40℃~+85℃
U27 = SN74HC32DR: 逻辑类型:或门;通道数:4;电源电压:2V~6V;静态电流(最大值):2uA;最大传播延迟:17ns@6V,50pF;; Supplier Part: C6838; Manufacturer: TI(德州仪器); Supplier Footprint: SOIC-14; JLCPCB Part Class: 扩展库; Datasheet: https://www.ti.com/cn/lit/gpn/sn74hc32; Supplier: LCSC; Logic Gate Type: 或门; Number of Channels: 4; Supply Voltage: 2V~6V; Quiescent Current (Max): 2uA; Sink Current: 5.2mA; Source Current: 5.2mA; High Level Range (VIH): 1.5V~4.2V; Low Level Range (VIL): 500mV~1.8V; Series: 74HC系列; Propagation Delay Time: 17ns@6V,50pF; Operating Temperature: -40℃~+85℃
U28 = SN74HC10DR: 逻辑类型:与非门;通道数:3;电源电压:2V~6V;静态电流(最大值):2uA;最大传播延迟:16ns@6V,50pF;; Supplier Part: C6816; Manufacturer: TI(德州仪器); Supplier Footprint: SOIC-14; JLCPCB Part Class: 扩展库; Datasheet: https://www.ti.com/cn/lit/gpn/sn74hc10; Supplier: LCSC; Logic Gate Type: 与非门; Number of Channels: 3; Supply Voltage: 2V~6V; Quiescent Current (Max): 2uA; Sink Current: 5.2mA; Source Current: 5.2mA; High Level Range (VIH): 1.5V~4.2V; Low Level Range (VIL): 500mV~1.8V; Series: 74HC系列; Propagation Delay Time: 16ns@6V,50pF; Operating Temperature: -40℃~+85℃
U29 = DSHP04TSGER_C3293144: 电路结构:单刀单掷;开关位数:4位;额定电流:25mA;额定电压:24V;使用寿命:3千次;颜色:黑色;; LCSC Part Name: 4位 1.27mm间距贴片型 KE拨码开关; Supplier Part: C3293144; Manufacturer: 康深; Supplier Footprint: SMD-8P,5.4x6.6mm; JLCPCB Part Class: 扩展库; Datasheet: https://atta.szlcsc.com/upload/public/pdf/source/20220713/C53382FBC579242FFD9AC69EAEDF7542.pdf; Supplier: LCSC; Circuit: 单刀单掷; Number of Positions: 4位; Lead Pitch: 1.27mm; Current Rating: 25mA; Voltage Rating: 24V; Operating Temperature: -30℃~+85℃; Operating Life: 3千次; Color: 黑色
U34 = SN74LS247DR: SN74LS247 BCD 到 7 段解码器/驱动器; Supplier Part: C2873230; Manufacturer: TI(德州仪器); Supplier Footprint: SOP-16; JLCPCB Part Class: 扩展库; Datasheet: https://www.ti.com/cn/lit/gpn/sn74ls247; Supplier: LCSC
C20 C21 C29 = CA45-A-16V-10uF-K: 容值:10uF;精度:±10%;额定电压:16V;等效串联电阻:10Ω@100kHz;; LCSC Part Name: 10uF ±10% 16V; Supplier Part: C128254; Manufacturer: CEC(振华新云); Supplier Footprint: CASE-A-3216; JLCPCB Part Class: 扩展库; Datasheet: https://atta.szlcsc.com/upload/public/pdf/source/20170914/C128254_1505359752472967905.pdf; Supplier: LCSC; Tolerance: ±10%; Rated Voltage: 16V; Equivalent Series Resistance(ESR): 10Ω@100kHz; Operating Temperature: -55℃~+125℃
C24 = CC0805KRX7R9BB104: 容值:100nF;精度:±10%;额定电压:50V;材质(温度系数):X7R;; LCSC Part Name: 100nF ±10% 50V; Supplier Part: C49678; Manufacturer: YAGEO(国巨); Supplier Footprint: 0805; JLCPCB Part Class: Basic Part; Datasheet: https://atta.szlcsc.com/upload/public/pdf/source/20180224/C181747_15194369449651363981.pdf; Supplier: LCSC; Tolerance: ±10%; Voltage Rated: 50V; Temperature Coefficient: X7R
C25 = 220UF/16V_C9900025507: LCSC Part Name: 220UF/16V; Supplier Part: C9900025507; Supplier Footprint: 220UF/16V; JLCPCB Part Class: 扩展库; Supplier: LCSC
C27 = CAP_0603: Supplier Footprint: 0603
D129 = TVS: Supplier Part: C9900021122; JLCPCB Part Class: 扩展库; Supplier: LCSC
H2 H6 = PZ254V-11-02P: 插针结构:1x2P;间距:2.54mm;行距:-;圆针/方针:方针;安装类型:直插;排数:单排;总PIN位数:2P;额定电流:-;额定电压:-;配合针长度:6mm;塑高:2.5mm;端接针长度:3mm;触头材质:黄铜;触头镀层:-;工作温度范围:-40℃~+105℃;颜色:黑色;; LCSC Part Name: 间距:2.54mm 1x2P 直插 方针; Supplier Part: C492401; Manufacturer: XFCN(兴飞); Supplier Footprint: 插件,P=2.54mm; JLCPCB Part Class: 扩展库; Datasheet: https://atta.szlcsc.com/upload/public/pdf/source/20200309/C492401_A812433581A9B211A7FFA413ADDFF0E5.pdf; Supplier: LCSC; Pin Structure: 1x2P; Pitch: 2.54mm; Circluar Pins/Square Pins: 方针; Mounting Type: 直插; Number of Rows: 单排; Number of Pins: 2P; Length of Mating Pin: 6mm; Insulation Height: 2.5mm; Length of End Connection Pin: 3mm; Contact Material: 黄铜; Operating Temperature Range: -40℃~+105℃; Color: 黑色
R33 R41 = 0603WAF1001T5E: 电阻类型:厚膜电阻;阻值:1kΩ;精度:±1%;功率:100mW;最大工作电压:75V;温度系数:±100ppm/℃;; LCSC Part Name: 1kΩ ±1% 100mW 厚膜电阻; Supplier Part: C21190; Manufacturer: UNI-ROYAL(厚声); Supplier Footprint: 0603; JLCPCB Part Class: Basic Part; Datasheet: https://atta.szlcsc.com/upload/public/pdf/source/20200306/C422600_1E6D84923E4A46A82E41ADD87F860B5C.pdf; Supplier: LCSC; Type: 厚膜电阻; Tolerance: ±1%; Power(Watts): 100mW; Overload Voltage (Max): 75V; Temperature Coefficient: ±100ppm/℃; Operating Temperature Range: -55℃~+155℃
R35 R36 R47 = 0603WAF1003T5E: 电阻类型:厚膜电阻;阻值:100kΩ;精度:±1%;功率:100mW;最大工作电压:75V;温度系数:±100ppm/℃;; LCSC Part Name: 100kΩ ±1% 100mW 厚膜电阻; Supplier Part: C25803; Manufacturer: UNI-ROYAL(厚声); Supplier Footprint: 0603; JLCPCB Part Class: Basic Part; Datasheet: https://atta.szlcsc.com/upload/public/pdf/source/20200306/C422600_1E6D84923E4A46A82E41ADD87F860B5C.pdf; Supplier: LCSC; Type: 厚膜电阻; Tolerance: ±1%; Power(Watts): 100mW; Overload Voltage (Max): 75V; Temperature Coefficient: ±100ppm/℃; Operating Temperature Range: -55℃~+155℃
R1-R8 R17-R32 R43 R46 = 0603WAF1002T5E: 电阻类型:厚膜电阻;阻值:10kΩ;精度:±1%;功率:100mW;最大工作电压:75V;温度系数:±100ppm/℃;; LCSC Part Name: 厚膜电阻 10kΩ ±1% 100mW; Supplier Part: C25804; Manufacturer: UNI-ROYAL(厚声); Supplier Footprint: 0603; JLCPCB Part Class: Basic Part; Datasheet: https://atta.szlcsc.com/upload/public/pdf/source/20200306/C422600_1E6D84923E4A46A82E41ADD87F860B5C.pdf; Supplier: LCSC; Type: 厚膜电阻; Tolerance: ±1%; Power(Watts): 100mW; Overload Voltage (Max): 75V; Temperature Coefficient: ±100ppm/℃; Operating Temperature Range: -55℃~+155℃
R71 R72 = 0603WAF4702T5E: 电阻类型:厚膜电阻;阻值:47kΩ;精度:±1%;功率:100mW;最大工作电压:75V;温度系数:±100ppm/℃;; LCSC Part Name: 47kΩ ±1% 100mW 厚膜电阻; Supplier Part: C25819; Manufacturer: UNI-ROYAL(厚声); Supplier Footprint: 0603; JLCPCB Part Class: Basic Part; Datasheet: https://atta.szlcsc.com/upload/public/pdf/source/20200306/C422600_1E6D84923E4A46A82E41ADD87F860B5C.pdf; Supplier: LCSC; Type: 厚膜电阻; Tolerance: ±1%; Power(Watts): 100mW; Overload Voltage (Max): 75V; Temperature Coefficient: ±100ppm/℃; Operating Temperature Range: -55℃~+155℃
R73 = RK09K1130ACL: 阻值:50kΩ;精度:±20%;功率:50mW;; LCSC Part Name: 50kΩ ±20%; Supplier Part: C470291; Manufacturer: ALPSALPINE(阿尔卑斯阿尔派); Supplier Footprint: 插件; JLCPCB Part Class: 扩展库; Datasheet: https://atta.szlcsc.com/upload/public/pdf/source/20191216/C470452_A95F493F84F2A4E5D2456A617FF6269D.pdf; Supplier: LCSC; Tolerance: ±20%; Rated Voltage: 20V; Power(Watts): 50mW
R74 = 3296W-1-103-8mm: 阻值:10kΩ;精度:±10%;; LCSC Part Name: 10kΩ ±10%; Supplier Part: C330432; Manufacturer: BOCHEN(博晨); Supplier Footprint: 插件; JLCPCB Part Class: 扩展库; Datasheet: https://atta.szlcsc.com/upload/public/pdf/source/20181127/C330432_1E3D0FAFEECED03876733B6304362580.pdf; Supplier: LCSC; Tolerance: ±10%
R76 = Res_0603: Supplier Footprint: 0603
SW3 SW4 = TS-1187A-B-A-B: 电路结构:单刀单掷;按钮形状:圆形按钮;作用力:160gf;安装方式:立贴;开关长度:5.1mm;开关宽度:5.1mm;开关高度:1.5mm;带支架:不带;触点电流:50mA;额定电压(DC):12V;绝缘电阻:-;带灯:无;机械寿命:10万次;; LCSC Part Name: 5.1*5.1*1.5mm 立贴 轻触开关; Supplier Part: C318884; Manufacturer: XKB Connectivity(中国星坤); Supplier Footprint: SMD; JLCPCB Part Class: Basic Part; Datasheet: https://atta.szlcsc.com/upload/public/pdf/source/20200227/C318890_053E50208A88A7BA1965D8746000774E.pdf; Supplier: LCSC; Circuit: 单刀单掷; Actuator Style: 圆形按钮; Operating Force: 160gf; Mounting Style: 立贴; Switch Length: 5.1mm; Switch Width: 5.1mm; Switch Height: 1.5mm; Strike Gundam: 不带; Contact Current: 50mA; Voltage Rating (DC): 12V; Actuator/Cap Color: 金色; With Lamp: 无; Mechanical Life: 10万次; Operating Temperature: -30℃~+85℃
U18 = 74HC14_C5356103: 输入类型:-;电源电压:2V~6V;供电电流(最大值):-;电路数:6;最大传播延迟(tpd):-;; Supplier Part: C5356103; Manufacturer: JSMSEMI(杰盛微); Supplier Footprint: SOP-14; JLCPCB Part Class: 扩展库; Datasheet: https://atta.szlcsc.com/upload/public/pdf/source/20240105/B746F3C4B5C6D4D99FE5FAFADEAB26B9.pdf; Supplier: LCSC; Supply Voltage(Single): 2V~6V; Number of Circuits: 6; Series: 74HC系列
U32 = NE555: Supplier Part: C504549; Supplier Footprint: SOP-8-4.0mm; JLCPCB Part Class: 扩展库; Supplier: LCSC
U33 = DSHP03TSGER: 电路结构:单刀单掷;开关位数:3位;额定电流:25mA;额定电压:24V;使用寿命:3千次;颜色:黑色;; LCSC Part Name: 3位 1.27mm脚距SMD KE拨码开关 拨动开关; Supplier Part: C3293143; Manufacturer: 康深; Supplier Footprint: SMD-6P,5.4x5.4mm; JLCPCB Part Class: 扩展库; Datasheet: https://atta.szlcsc.com/upload/public/pdf/source/20220713/FAF69AA36D813625C88F516AF6B242B3.pdf; Supplier: LCSC; Circuit: 单刀单掷; Number of Positions: 3位; Lead Pitch: 1.27mm; Current Rating: 25mA; Voltage Rating: 24V; Operating Temperature: -30℃~+85℃; Operating Life: 3千次; Color: 黑色
USB2 = KH-TYPE-C-16P: 连接器类型:Type-C;标准:-;公母:母;端口数量:1;触点数量:16P;安装方式:卧贴;额定电流 - 电源:3A;工作温度范围:-40℃~+85℃;; LCSC Part Name: Type-C 母 卧贴; Supplier Part: C709357; Manufacturer: kinghelm(金航标); Supplier Footprint: SMD; JLCPCB Part Class: 扩展库; Datasheet: https://atta.szlcsc.com/upload/public/pdf/source/20200911/C709357_AA8DCEB38BB20E3035A7ED7AE7667837.pdf; Supplier: LCSC; Connector Type: Type-C; Gender: 母; Number of Ports: 1; Number of Contacts: 16P; Mounting Style: 卧贴; Current Rating - Power (Max): 3A; Operating Temperature Range: -40℃~+85℃
D1-D128 = 1N5819WS_C191023: 正向压降(Vf):600mV@1A;直流反向耐压(Vr):40V;平均整流电流(Io):1A;; LCSC Part Name: 电压:40V 电流:1A; Supplier Part: C191023; Manufacturer: Hottech(合科泰); Supplier Footprint: SOD-323; JLCPCB Part Class: 基础库; Datasheet: https://atta.szlcsc.com/upload/public/pdf/source/20220428/3CB86FD8D28D653594B4E35F9D5AEFD9.pdf; Supplier: LCSC; Forward Voltage (Vf@If): 600mV@1A; Reverse Voltage (Vr): 40V; Average Rectified Current (Io): 1A
LED0-LED23 = YLED0603G: 发光颜色:翠绿色;正向电压(VF):2.7V~3.2V;功率:-;正向电流:25mA;主波长:510nm~531nm;二极管配置:-;透镜颜色:-;色温:-;发光强度:-;发光角度:-;载带方式:-;工作温度:-40℃~+85℃;; Supplier Part: C19273151; Manufacturer: YONGYUTAI(永裕泰); Supplier Footprint: 0603; JLCPCB Part Class: Extended Part; Datasheet: https://atta.szlcsc.com/upload/public/pdf/source/20231201/6896CD173B7817C61CFF421DECB2B9C4.pdf; Supplier: LCSC; Emitted Color: 翠绿色; Forward Voltage (VF): 2.7V~3.2V; Forward Current: 25mA; Dominant Wavelength: 510nm~531nm; Operating Temperature: -40℃~+85℃
U0-U15 = SMXMS-08K-TR: 开关位数:8位;额定电流:25mA;额定电压:24V;颜色:黑色;; Supplier Part: C19272179; Manufacturer: SM Switch; Supplier Footprint: SMD-16P,11.7x5.4mm; JLCPCB Part Class: Extended Part; Datasheet: https://atta.szlcsc.com/upload/public/pdf/source/20231201/0B8F56A69CBF455804D104C3EC37CB85.pdf; Supplier: LCSC; Number of Positions: 8位; Lead Pitch: 1.27mm; Current Rating: 25mA; Voltage Rating: 24V; Operating Temperature: -30℃~+85℃; Color: 黑色
U16 = SN74HC540PWR: 输入类型:-;电源电压:2V~6V;元件数:1;每个元件位数:8;灌电流(IOL):7.8mA;拉电流(IOH):7.8mA;; Supplier Part: C2682166; Manufacturer: TI(德州仪器); Supplier Footprint: TSSOP-20; JLCPCB Part Class: 扩展库; Datasheet: https://www.ti.com/cn/lit/gpn/sn54hc540; Supplier: LCSC; output type: 三态; Supply Voltage: 2V~6V; Number of Elements: 1; Number of Bits per Element: 8; Sink Current: 7.8mA; Source Current: 7.8mA; Logic Family: 74HC; Operating Temperature: -40℃~+85℃
U17 = SN74HC154DR(LX): Supplier Part: C41413099; Manufacturer: LX(灵星芯微); Supplier Footprint: SOP-24; Datasheet: https://atta.szlcsc.com/upload/public/pdf/source/20240923/0BF8EBFBC2EE7843BBF2E86797CF806E.pdf; Supplier: LCSC

## Nets
+5V: C1.1 C2.1 C3.1 C4.1 C5.1 C6.1 C7.1 C8.1 C9.1 C10.1 C11.1 C12.1 C13.1 C14.2 C15.1 C16.1 C24.2 C25.1 C26.1 C28.1 D129.1 H5.7 H6.1 LED8.2(A) LED9.2(A) LED10.2(A) LED11.2(A) LED12.2(A) LED13.2(A) LED14.2(A) LED15.2(A) LED16.2(A) LED17.2(A) LED18.2(A) LED19.2(A) LED20.2(A) LED21.2(A) LED22.2(A) LED23.2(A) LED24.2(A) LED39.3(VCC) LED39.8(VCC) R1.2 R2.2 R3.2 R4.2 R5.2 R6.2 R7.2 R8.2 R33.2 R38.1 R41.2 R48.2 R76.1 SW1.1 SW1.4 SW5.2 SW5.3 SW5.5 SW5.6 U16.20(VCC) U17.24(VCC) U18.14(VCC) U19.16(VCC) U20.16(VCC) U21.16(VCC) U22.7(PE) U22.10(TE) U22.16(VCC) U23.16(VCC) U24.16(VCC) U25.16(VCC) U26.4(1PRE#) U26.14(VCC) U27.14(VCC) U28.3(2A) U28.4(2B) U28.11(3C) U28.14(VCC) U29.5 U29.6 U29.7 U29.8 U32.4(RESET) U32.8(VCC) U34.4(BI#/RBO#) U34.5(RBI#) U34.16(VCC)
GND: C1.2 C2.2 C3.2 C4.2 C5.2 C6.2 C7.2 C8.2 C9.2 C10.2 C11.2 C12.2 C13.2 C14.1 C15.2 C16.2 C20.2 C21.2 C24.1 C25.2 C26.2 C27.1 C28.2 C29.2 D129.2 H5.8 H6.2 LED25.1(C) LED26.1(C) LED27.1(C) LED28.1(C) LED29.1(C) LED30.1(C) LED31.1(C) LED32.1(C) LED33.1(C) LED34.1(C) LED35.1(C) LED36.1(C) LED37.1(C) LED38.1(C) LED40.1(C) LED42.1(C) R9.1 R10.1 R11.1 R12.1 R13.1 R14.1 R15.1 R16.1 SW1.3 SW1.6 SW3.3(C) SW3.4(D) SW4.3(C) SW4.4(D) U16.1(OE1#) U16.10(GND) U16.19(OE2#) U17.12(GND) U17.18(E0#) U17.19(E1#) U18.7(GND) U19.7(PE) U19.8(GND) U19.10(TE) U20.7(PE) U20.8(GND) U20.10(TE) U21.7(PE) U21.8(GND) U21.10(TE) U22.8(GND) U23.1(1G#) U23.3(1C3) U23.8(GND) U23.13(2C3) U23.15(2G#) U24.1(1G#) U24.3(1C3) U24.8(GND) U24.13(2C3) U24.15(2G#) U25.7(CIN) U25.8(GND) U26.7(GND) U27.7(GND) U28.7(GND) U32.1(GND) U34.8(GND) USB2.A1(GND) USB2.A12(GND) USB2.B1(GND) USB2.B12(GND)
VCC: SW5.1 SW5.4 USB2.A4(VBUS) USB2.A9(VBUS) USB2.B4(VBUS) USB2.B9(VBUS)
A0: U19.14(Q0) U23.6(1C0)
A1: U19.13(Q1) U23.10(2C0)
A2: U19.12(Q2) U24.6(1C0)
A3: U19.11(Q3) U24.10(2C0)
ADD0: U19.3(P0) U20.3(P0) U21.3(P0) U22.3(P0) U25.4(S1)
ADD1: U19.4(P1) U20.4(P1) U21.4(P1) U22.4(P1) U25.1(S2)
ADD2: U19.5(P2) U20.5(P2) U21.5(P2) U22.5(P2) U25.13(S3)
ADD3: U19.6(P3) U20.6(P3) U21.6(P3) U22.6(P3) U25.10(S4)
B0: U20.14(Q0) U23.5(1C1)
B1: U20.13(Q1) U23.11(2C1)
B2: U20.12(Q2) U24.5(1C1)
B3: U20.11(Q3) U24.11(2C1)
CLK: H2.2 H5.6 U18.5(3A) U19.2(CP) U20.2(CP) U21.2(CP) U22.2(CP) U26.3(1CLK)
DATA0: U23.7(1Y) U25.5(A1)
DATA1: U23.9(2Y) U25.3(A2)
DATA2: U24.7(1Y) U25.14(A3)
DATA3: U24.9(2Y) U25.12(A4)
IN0: H1.4 R56.1 U23.4(1C2) U29.4
IN1: H1.3 R57.1 U23.12(2C2) U29.3
IN2: H1.2 R58.1 U24.4(1C2) U29.2
IN3: H1.1 R59.1 U24.12(2C2) U29.1
IROM0: D1.1(K) D2.1(K) D3.1(K) D4.1(K) D5.1(K) D6.1(K) D7.1(K) D8.1(K) R17.1 U17.1(Y0#)
IROM1: D9.1(K) D10.1(K) D11.1(K) D12.1(K) D13.1(K) D14.1(K) D15.1(K) D16.1(K) R18.1 U17.2(Y1#)
IROM2: D17.1(K) D18.1(K) D19.1(K) D20.1(K) D21.1(K) D22.1(K) D23.1(K) D24.1(K) R19.1 U17.3(Y2#)
IROM3: D25.1(K) D26.1(K) D27.1(K) D28.1(K) D29.1(K) D30.1(K) D31.1(K) D32.1(K) R20.1 U17.4(Y3#)
IROM4: D33.1(K) D34.1(K) D35.1(K) D36.1(K) D37.1(K) D38.1(K) D39.1(K) D40.1(K) R21.1 U17.5(Y4#)
IROM5: D41.1(K) D42.1(K) D43.1(K) D44.1(K) D45.1(K) D46.1(K) D47.1(K) D48.1(K) R22.1 U17.6(Y5#)
IROM6: D49.1(K) D50.1(K) D51.1(K) D52.1(K) D53.1(K) D54.1(K) D55.1(K) D56.1(K) R23.1 U17.7(Y6#)
IROM7: D57.1(K) D58.1(K) D59.1(K) D60.1(K) D61.1(K) D62.1(K) D63.1(K) D64.1(K) R24.1 U17.8(Y7#)
IROM8: D65.1(K) D66.1(K) D67.1(K) D68.1(K) D69.1(K) D70.1(K) D71.1(K) D72.1(K) R25.1 U17.9(Y8#)
IROM9: D73.1(K) D74.1(K) D75.1(K) D76.1(K) D77.1(K) D78.1(K) D79.1(K) D80.1(K) R26.1 U17.10(Y9#)
IROM10: D81.1(K) D82.1(K) D83.1(K) D84.1(K) D85.1(K) D86.1(K) D87.1(K) D88.1(K) R27.1 U17.11(Y10#)
IROM11: D89.1(K) D90.1(K) D91.1(K) D92.1(K) D93.1(K) D94.1(K) D95.1(K) D96.1(K) R28.1 U17.13(Y11#)
IROM12: D97.1(K) D98.1(K) D99.1(K) D100.1(K) D101.1(K) D102.1(K) D103.1(K) D104.1(K) R29.1 U17.14(Y12#)
IROM13: D105.1(K) D106.1(K) D107.1(K) D108.1(K) D109.1(K) D110.1(K) D111.1(K) D112.1(K) R30.1 U17.15(Y13#)
IROM14: D113.1(K) D114.1(K) D115.1(K) D116.1(K) D117.1(K) D118.1(K) D119.1(K) D120.1(K) R31.1 U17.16(Y14#)
IROM15: D121.1(K) D122.1(K) D123.1(K) D124.1(K) D125.1(K) D126.1(K) D127.1(K) D128.1(K) R32.1 U17.17(Y15#)
LOAD0: R50.2 U19.9(SPE#) U27.3(1Y)
LOAD1: R51.2 U20.9(SPE#) U27.8(3Y)
LOAD2: R52.2 U21.9(SPE#) U28.8(3Y)
LOAD3: R53.2 U22.9(SPE#) U28.12(1Y)
OROM0: R1.1 U0.16(PIN16) U1.16(PIN16) U2.16(PIN16) U3.16(PIN16) U4.16(PIN16) U5.16(PIN16) U6.16(PIN16) U7.16(PIN16) U8.16(PIN16) U9.16(PIN16) U10.16(PIN16) U11.16(PIN16) U12.16(PIN16) U13.16(PIN16) U14.16(PIN16) U15.16(PIN16) U16.9(A8)
OROM1: R2.1 U0.15(PIN15) U1.15(PIN15) U2.15(PIN15) U3.15(PIN15) U4.15(PIN15) U5.15(PIN15) U6.15(PIN15) U7.15(PIN15) U8.15(PIN15) U9.15(PIN15) U10.15(PIN15) U11.15(PIN15) U12.15(PIN15) U13.15(PIN15) U14.15(PIN15) U15.15(PIN15) U16.8(A7)
OROM2: R3.1 U0.14(PIN14) U1.14(PIN14) U2.14(PIN14) U3.14(PIN14) U4.14(PIN14) U5.14(PIN14) U6.14(PIN14) U7.14(PIN14) U8.14(PIN14) U9.14(PIN14) U10.14(PIN14) U11.14(PIN14) U12.14(PIN14) U13.14(PIN14) U14.14(PIN14) U15.14(PIN14) U16.7(A6)
OROM3: R4.1 U0.13(PIN13) U1.13(PIN13) U2.13(PIN13) U3.13(PIN13) U4.13(PIN13) U5.13(PIN13) U6.13(PIN13) U7.13(PIN13) U8.13(PIN13) U9.13(PIN13) U10.13(PIN13) U11.13(PIN13) U12.13(PIN13) U13.13(PIN13) U14.13(PIN13) U15.13(PIN13) U16.6(A5)
OROM4: R5.1 U0.12(PIN12) U1.12(PIN12) U2.12(PIN12) U3.12(PIN12) U4.12(PIN12) U5.12(PIN12) U6.12(PIN12) U7.12(PIN12) U8.12(PIN12) U9.12(PIN12) U10.12(PIN12) U11.12(PIN12) U12.12(PIN12) U13.12(PIN12) U14.12(PIN12) U15.12(PIN12) U16.5(A4)
OROM5: R6.1 U0.11(PIN11) U1.11(PIN11) U2.11(PIN11) U3.11(PIN11) U4.11(PIN11) U5.11(PIN11) U6.11(PIN11) U7.11(PIN11) U8.11(PIN11) U9.11(PIN11) U10.11(PIN11) U11.11(PIN11) U12.11(PIN11) U13.11(PIN11) U14.11(PIN11) U15.11(PIN11) U16.4(A3)
OROM6: R7.1 U0.10(PIN10) U1.10(PIN10) U2.10(PIN10) U3.10(PIN10) U4.10(PIN10) U5.10(PIN10) U6.10(PIN10) U7.10(PIN10) U8.10(PIN10) U9.10(PIN10) U10.10(PIN10) U11.10(PIN10) U12.10(PIN10) U13.10(PIN10) U14.10(PIN10) U15.10(PIN10) U16.3(A2)
OROM7: R8.1 U0.9(PIN9) U1.9(PIN9) U2.9(PIN9) U3.9(PIN9) U4.9(PIN9) U5.9(PIN9) U6.9(PIN9) U7.9(PIN9) U8.9(PIN9) U9.9(PIN9) U10.9(PIN9) U11.9(PIN9) U12.9(PIN9) U13.9(PIN9) U14.9(PIN9) U15.9(PIN9) U16.2(A1)
OUT0: H3.4 H5.4 R60.1 U21.14(Q0) U34.7(A)
OUT1: H3.3 H5.3 R61.1 U21.13(Q1) U34.1(B)
OUT2: H3.2 H5.2 R62.1 U21.12(Q2) U34.2(C)
OUT3: H3.1 H5.1 R63.1 U21.11(Q3) U34.6(D)
PC0: U17.23(A0) U22.14(Q0)
PC1: U17.22(A1) U22.13(Q1)
PC2: U17.21(A2) U22.12(Q2)
PC3: U17.20(A3) U22.11(Q3)
RESET: H5.5 U18.4(2Y) U19.1(MR#) U20.1(MR#) U21.1(MR#) U22.1(MR#) U26.1(1CLR#)
ROM0: LED0.2(A) U16.18(Y1) U25.6(B1)
ROM1: LED1.2(A) U16.17(Y2) U25.2(B2)
ROM2: LED2.2(A) U16.16(Y3) U25.15(B3)
ROM3: LED3.2(A) U16.15(Y4) U25.11(B4)
ROM4: LED4.2(A) U16.14(Y5) U27.4(2A) U27.13(4B)
ROM5: LED5.2(A) R55.1 U16.13(Y6) U23.2(B) U24.2(B)
ROM6: LED6.2(A) U16.12(Y7) U27.1(1A) U28.5(2C) U28.13(1C)
ROM7: LED7.2(A) U16.11(Y8) U27.2(1B) U27.5(2B) U27.10(3B) U28.1(1A) U28.10(3B)
SEGA: LED39.7(a) R70.2
SEGB: LED39.6(b) R69.2
SEGC: LED39.4(c) R68.2
SEGD: LED39.2(d) R67.2
SEGE: LED39.1(e) R66.2
SEGF: LED39.9(f) R64.2
SEGG: LED39.10(g) R65.2
SEL1_A: R54.1 U23.14(A) U24.14(A) U27.6(2Y)
$1N2944: D1.2(A) U0.1(PIN1)
$1N2976: D2.2(A) U0.2(PIN2)
$1N3008: D3.2(A) U0.3(PIN3)
$1N3040: D5.2(A) U0.4(PIN4)
$1N3072: D4.2(A) U0.5(PIN5)
$1N3104: D7.2(A) U0.6(PIN6)
$1N3136: D6.2(A) U0.7(PIN7)
$1N3168: D8.2(A) U0.8(PIN8)
$1N52606: D9.2(A) U1.1(PIN1)
$1N52607: D11.2(A) U1.2(PIN2)
$1N52608: D10.2(A) U1.3(PIN3)
$1N52609: D13.2(A) U1.4(PIN4)
$1N52610: D12.2(A) U1.5(PIN5)
$1N52611: D15.2(A) U1.6(PIN6)
$1N52612: D14.2(A) U1.7(PIN7)
$1N52613: D16.2(A) U1.8(PIN8)
$1N52878: D17.2(A) U2.1(PIN1)
$1N52879: D19.2(A) U2.2(PIN2)
$1N52880: D18.2(A) U2.3(PIN3)
$1N52881: D20.2(A) U2.4(PIN4)
$1N52882: D21.2(A) U2.5(PIN5)
$1N52883: D23.2(A) U2.6(PIN6)
$1N52884: D22.2(A) U2.7(PIN7)
$1N52885: D24.2(A) U2.8(PIN8)
$1N53150: D33.2(A) U4.1(PIN1)
$1N53151: D35.2(A) U4.2(PIN2)
$1N53152: D34.2(A) U4.3(PIN3)
$1N53153: D37.2(A) U4.4(PIN4)
$1N53154: D36.2(A) U4.5(PIN5)
$1N53155: D39.2(A) U4.6(PIN6)
$1N53156: D38.2(A) U4.7(PIN7)
$1N53157: D40.2(A) U4.8(PIN8)
$1N53702: D41.2(A) U5.1(PIN1)
$1N53703: D43.2(A) U5.2(PIN2)
$1N53704: D42.2(A) U5.3(PIN3)
$1N53705: D45.2(A) U5.4(PIN4)
$1N53706: D44.2(A) U5.5(PIN5)
$1N53707: D47.2(A) U5.6(PIN6)
$1N53708: D46.2(A) U5.7(PIN7)
$1N53709: D48.2(A) U5.8(PIN8)
$1N53974: D49.2(A) U6.1(PIN1)
$1N53975: D51.2(A) U6.2(PIN2)
$1N53976: D50.2(A) U6.3(PIN3)
$1N53977: D53.2(A) U6.4(PIN4)
$1N53978: D52.2(A) U6.5(PIN5)
$1N53979: D55.2(A) U6.6(PIN6)
$1N53980: D54.2(A) U6.7(PIN7)
$1N53981: D56.2(A) U6.8(PIN8)
$1N54246: D25.2(A) U3.1(PIN1)
$1N54247: D27.2(A) U3.2(PIN2)
$1N54248: D26.2(A) U3.3(PIN3)
$1N54249: D29.2(A) U3.4(PIN4)
$1N54250: D28.2(A) U3.5(PIN5)
$1N54251: D31.2(A) U3.6(PIN6)
$1N54252: D30.2(A) U3.7(PIN7)
$1N54253: D32.2(A) U3.8(PIN8)
$1N54518: D57.2(A) U7.1(PIN1)
$1N54519: D58.2(A) U7.2(PIN2)
$1N54520: D59.2(A) U7.3(PIN3)
$1N54521: D61.2(A) U7.4(PIN4)
$1N54522: D60.2(A) U7.5(PIN5)
$1N54523: D63.2(A) U7.6(PIN6)
$1N54524: D62.2(A) U7.7(PIN7)
$1N54525: D64.2(A) U7.8(PIN8)
$1N54790: D65.2(A) U8.1(PIN1)
$1N54791: D67.2(A) U8.2(PIN2)
$1N54792: D66.2(A) U8.3(PIN3)
$1N54793: D68.2(A) U8.4(PIN4)
$1N54794: D69.2(A) U8.5(PIN5)
$1N54795: D70.2(A) U8.6(PIN6)
$1N54796: D71.2(A) U8.7(PIN7)
$1N54797: D72.2(A) U8.8(PIN8)
$1N55062: D73.2(A) U9.1(PIN1)
$1N55063: D75.2(A) U9.2(PIN2)
$1N55064: D74.2(A) U9.3(PIN3)
$1N55065: D77.2(A) U9.4(PIN4)
$1N55066: D76.2(A) U9.5(PIN5)
$1N55067: D79.2(A) U9.6(PIN6)
$1N55068: D78.2(A) U9.7(PIN7)
$1N55069: D80.2(A) U9.8(PIN8)
$1N55334: D81.2(A) U10.1(PIN1)
$1N55335: D83.2(A) U10.2(PIN2)
$1N55336: D82.2(A) U10.3(PIN3)
$1N55337: D85.2(A) U10.4(PIN4)
$1N55338: D84.2(A) U10.5(PIN5)
$1N55339: D87.2(A) U10.6(PIN6)
$1N55340: D86.2(A) U10.7(PIN7)
$1N55341: D88.2(A) U10.8(PIN8)
$1N55606: D89.2(A) U11.1(PIN1)
$1N55607: D91.2(A) U11.2(PIN2)
$1N55608: D90.2(A) U11.3(PIN3)
$1N55609: D93.2(A) U11.4(PIN4)
$1N55610: D92.2(A) U11.5(PIN5)
$1N55611: D95.2(A) U11.6(PIN6)
$1N55612: D94.2(A) U11.7(PIN7)
$1N55613: D96.2(A) U11.8(PIN8)
$1N55878: D97.2(A) U12.1(PIN1)
$1N55879: D99.2(A) U12.2(PIN2)
$1N55880: D98.2(A) U12.3(PIN3)
$1N55881: D101.2(A) U12.4(PIN4)
$1N55882: D100.2(A) U12.5(PIN5)
$1N55883: D103.2(A) U12.6(PIN6)
$1N55884: D102.2(A) U12.7(PIN7)
$1N55885: D104.2(A) U12.8(PIN8)
$1N56150: D105.2(A) U13.1(PIN1)
$1N56151: D107.2(A) U13.2(PIN2)
$1N56152: D106.2(A) U13.3(PIN3)
$1N56153: D109.2(A) U13.4(PIN4)
$1N56154: D108.2(A) U13.5(PIN5)
$1N56155: D110.2(A) U13.6(PIN6)
$1N56156: D111.2(A) U13.7(PIN7)
$1N56157: D112.2(A) U13.8(PIN8)
$1N56422: D113.2(A) U14.1(PIN1)
$1N56423: D115.2(A) U14.2(PIN2)
$1N56424: D114.2(A) U14.3(PIN3)
$1N56425: D116.2(A) U14.4(PIN4)
$1N56426: D117.2(A) U14.5(PIN5)
$1N56427: D119.2(A) U14.6(PIN6)
$1N56428: D118.2(A) U14.7(PIN7)
$1N56429: D120.2(A) U14.8(PIN8)
$1N56694: D121.2(A) U15.1(PIN1)
$1N56695: D123.2(A) U15.2(PIN2)
$1N56696: D122.2(A) U15.3(PIN3)
$1N56697: D125.2(A) U15.4(PIN4)
$1N56698: D124.2(A) U15.5(PIN5)
$1N56699: D126.2(A) U15.6(PIN6)
$1N56700: D127.2(A) U15.7(PIN7)
$1N56701: D128.2(A) U15.8(PIN8)
$1N73152: LED8.1(C) R17.2
$1N73191: LED9.1(C) R18.2
$1N73193: LED10.1(C) R19.2
$1N73195: LED11.1(C) R20.2
$1N73197: LED12.1(C) R21.2
$1N73199: LED13.1(C) R22.2
$1N73297: LED14.1(C) R23.2
$1N73397: LED15.1(C) R24.2
$1N73422: LED16.1(C) R25.2
$1N73447: LED17.1(C) R26.2
$1N73472: LED18.1(C) R27.2
$1N73497: LED19.1(C) R28.2
$1N73522: LED20.1(C) R29.2
$1N73547: LED21.1(C) R30.2
$1N73572: LED22.1(C) R31.2
$1N73597: LED23.1(C) R32.2
$1N74175: LED0.1(C) R9.2
$1N74177: LED1.1(C) R10.2
$1N74179: LED2.1(C) R11.2
$1N74181: LED3.1(C) R12.2
$1N74183: LED4.1(C) R13.2
$1N74185: LED5.1(C) R14.2
$1N74187: LED6.1(C) R15.2
$1N74189: LED7.1(C) R16.2
$2N4793: LED38.2(A) R63.2
$2N4843: LED35.2(A) R60.2
$2N4848: LED36.2(A) R61.2
$2N4853: LED37.2(A) R62.2
$2N9595: U26.5(1Q) U27.12(4A)
$2N9604: U27.11(4Y) U28.2(1B)
$2N9707: U27.9(3A) U28.6(2Y) U28.9(3A)
$2N10072: U25.9(COUT) U26.2(1D)
$2N15297: LED25.2(A) R50.1
$2N15298: LED26.2(A) R51.1
$2N15299: LED27.2(A) R52.1
$2N15300: LED28.2(A) R53.1
$2N15547: LED30.2(A) R55.2
$2N15552: LED29.2(A) R54.2
$2N17443: LED31.2(A) R56.2
$2N17446: LED32.2(A) R57.2
$2N17449: LED33.2(A) R58.2
$2N17452: LED34.2(A) R59.2
$2N43264: LED24.1(C) R49.1
$2N43269: R49.2 U26.6(1Q#)
$2N51445: SW1.2 SW1.5 U34.3(LT#)
$2N53801: R64.1 U34.15(f)
$2N53807: R65.1 U34.14(g)
$2N53815: R70.1 U34.13(a)
$2N53821: R69.1 U34.12(b)
$2N53825: R68.1 U34.11(c)
$2N53832: R67.1 U34.10(d)
$2N53839: R66.1 U34.9(e)
$3N1652: R43.1 SW2.1 SW2.4
$3N1879: R41.1 R46.1 SW3.1(A) SW3.2(B)
$3N2060: R47.2 U18.9(4A)
$3N2116: R42.2 U18.8(4Y)
$3N2121: R42.1 SW2.3 SW2.6
$3N2181: C20.1 R46.2 R47.1
$3N2476: R33.1 R35.1 SW4.1(A) SW4.2(B)
$3N2610: C21.1 R35.2 R36.1
$3N2636: R36.2 U18.1(1A)
$3N2642: R34.1 U18.2(1Y) U18.3(2A)
$3N5038: LED41.1(C) U18.6(3Y)
$3N5184: LED42.2(A) R48.1
$3N8109: LED40.2(A) R34.2
$3N8181: LED41.2(A) R38.2
$3N13238: H2.1 SW2.2 SW2.5
$3N18753: C27.2 U32.5(CONT)
$3N18758: C29.1 R71.2 R72.2 R73.1 R73.2 U32.2(TRIG) U32.6(THRES)
$3N18776: R43.2 U18.10(5Y)
$3N18780: U18.13(6A) U32.3(OUT)
$3N18803: U18.11(5A) U18.12(6Y)
$3N19354: R73.3 R74.1 R74.2
$3N19413: R71.1 U33.6(B1)
$3N19420: R72.1 U33.5(B2)
$3N19452: R74.3 U33.4(B3)
$3N19512: R76.2 U32.7(DISCH) U33.1(A1) U33.2(A2) U33.3(A3)

Not connected (* = marked no-connect by the designer): LED39 5(dp)*; R73 4* 5*; U19 15(TC)*; U20 15(TC)*; U21 15(TC)*; U22 15(TC)*; U26 8(2Q#)* 9(2Q)* 10(2PRE#)* 11(2CLK)* 12(2D)* 13(2CLR#)*; USB2 1(EP)* 2(EP)* 3(EP)* 4(EP)* A5(CC1)* A6(DP1)* A7(DN1)* A8(SUB1)* B5(CC2)* B6(DP2)* B7(DN2)* B8(SUB2)*

## Notes on the sheets
sheet 1
- ROM
sheet 2
- reg_A
- MUX1
- ADD
- reg_B
- MUX2
- reg_OUT
- LOGIC UNIT
- reg_PC
- OUTPUT
sheet 3
- CLOCK&RESET
- POWER
